# Altium project P22296-1.PrjPcb (part 2 of 3)

## Sheet BatteryMonitor.SchDoc: Titel
size A3; ApprovedBy: name; CompanyName: DCI Electronics bv; DrawnBy: KRS; Address1: Nijverheidsstraat 14; Address2: 4458 AV Eindewege; Address3: Phone: +31 (0)113 344880; DocumentNumber: 8; Revision: 2; SheetNumber: 8; SheetTotal: 14; PageSetup: Record=PageOptions|CenterHorizontal=True|CenterVertical=True|PrintScale=1.00|XCorrection=1.00|YCorrection=1.00|PrintKind=1|BorderSize=5000000|LeftOffset=0|BottomOffset=0|Orientation=2|PaperLength=1000|PaperWidth=1000|Scale=100|PaperSource=7|PrintQuality=-4|MediaType=1|DitherType=10|PaperKind=ISO_A4_(210.00_x_297.00_MM)|PrintScaleMode=1; SubTitle: SubTitel; ApprovedDate: 01-01-12; DesignedBy: KRS
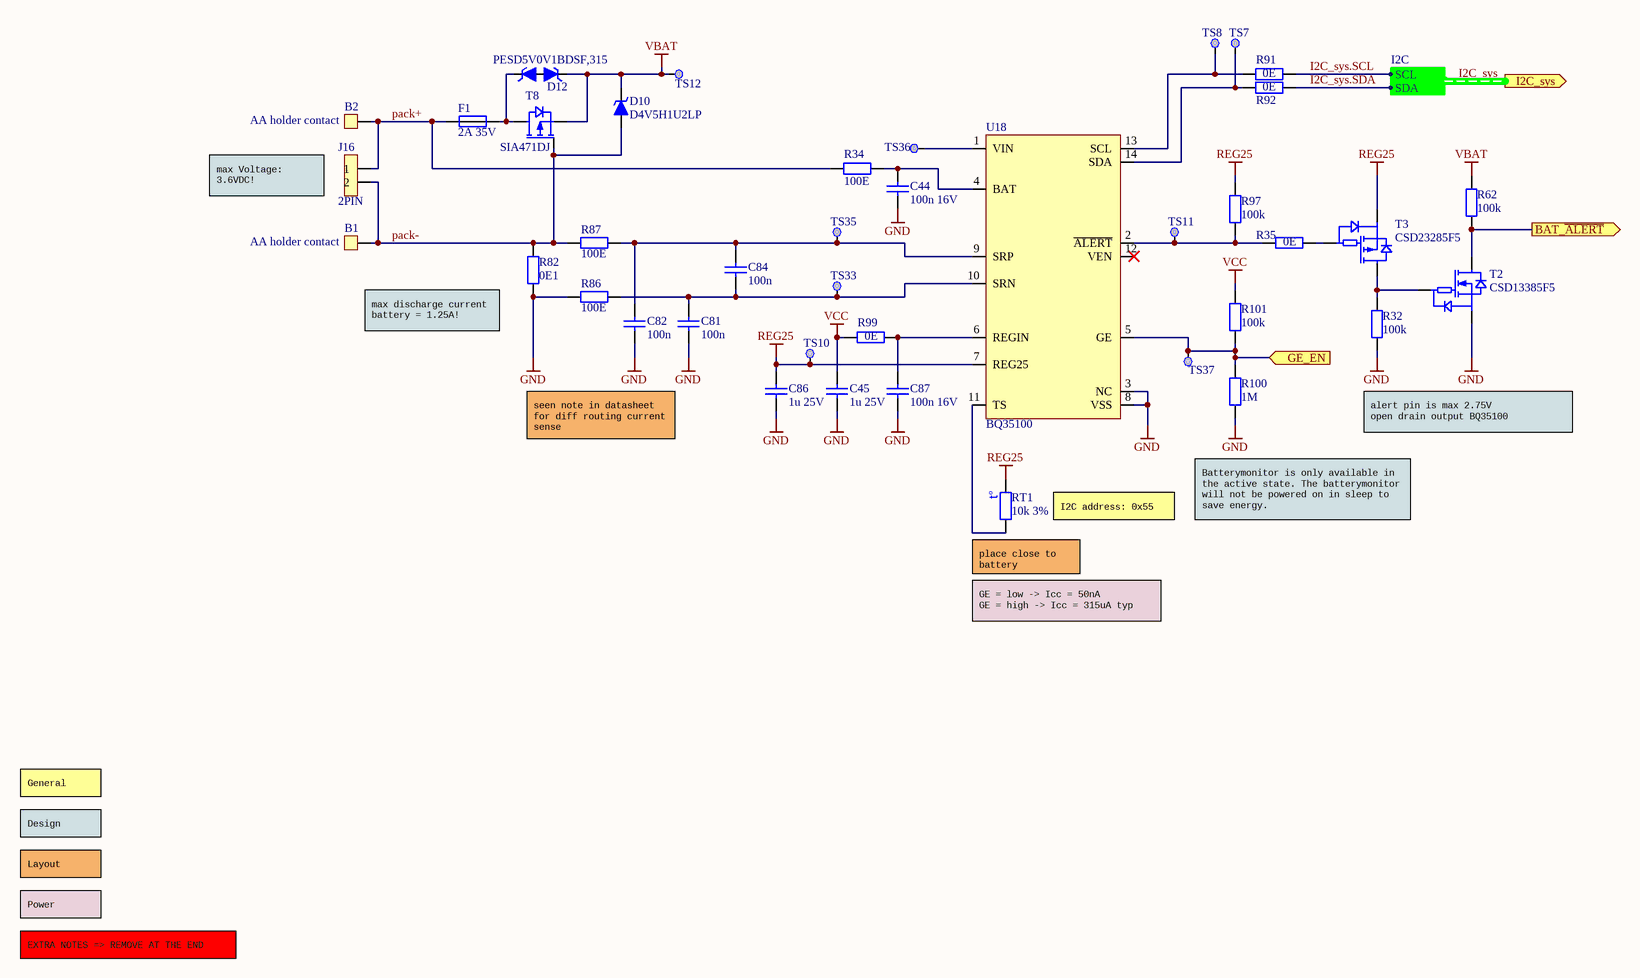
[diagram p7: BatteryMonitor.SchDoc]

### Parts
B1  AA holder contact  [ADD-900G002-000]
B2  AA holder contact  [ADD-900G002-000]
C44  100n 16V  [CAPC1005X05N]
C45  1u 25V  [CAPC1608X09N]
C81  100n  [CAPC1608X09N]
C82  100n  [CAPC1608X09N]
C84  100n  [CAPC1608X09N]
C86  1u 25V  [CAPC1608X09N]
C87  100n 16V  [CAPC1005X05N]
D10  D4V5H1U2LP  [DFN110P160X55-2N]
D12  PESD5V0V1BDSF,315  [DIO-000G003-002]
F1  2A 35V  [Fuse1608X05N]
J16  2PIN  [JST-B2B-PH-SM4-TB]
R32  100k  [RESC1005X04N]
R34  100E  [RESC1005X04N]
R35  0E  [RESC1005X04N]
R62  100k  [RESC1005X04N]
R82  0E1  [RESC3116X13L]
R86  100E  [RESC1608X13N]
R87  100E  [RESC1608X13N]
R91  0E  [RESC1005X04N]
R92  0E  [RESC1005X04N]
R97  100k  [RESC1005X04N]
R99  0E  [RESC1005X04N]
R100  1M  [RESC1005x04N]
R101  100k  [RESC1005X04N]
RT1  10k 3%  [RESC2013X14M]
T2  CSD13385F5  [DFN-500G000-003]
T3  CSD23285F5  [DFN-500G000-003]
T8  SIA471DJ  [PAK-SC70-6]
TS7  TESTPAD  [TESTPAD 2MM]  (value not drawn)  (no BOM)
TS8  TESTPAD  [TESTPAD 2MM]  (value not drawn)  (no BOM)
TS10  TESTPAD  [TESTPAD 2MM]  (value not drawn)  (no BOM)
TS11  TESTPAD  [TESTPAD 2MM]  (value not drawn)  (no BOM)
TS12  TESTPAD  [TESTPAD 2MM]  (value not drawn)  (no BOM)
TS33  TESTPOINT  [testpad 1.5 mm]  (value not drawn)  (no BOM)
TS35  TESTPOINT  [testpad 1.5 mm]  (value not drawn)  (no BOM)
TS36  TESTPAD  [TESTPAD 2MM]  (value not drawn)  (no BOM)
TS37  TESTPAD  [TESTPAD 2MM]  (value not drawn)  (no BOM)
U18  BQ35100  [SOP-650G001-014]

### Ports
BAT_~{ALERT} (out), GE_EN (in), I2C_sys (out, harness I2C)

### Harnesses
I2C: SDA, SCL

### Nets
GND: C44.1 C45.1 C81.1 C82.1 C86.1 C87.1 R32.1 R82.1 R86.1 R100.1 T2.S U18.3(NC) U18.8(VSS)
REG25: C86.2 R97.2 RT1.1 T3.S TS10.1(TP) U18.7(REG25)
VBAT: D10.C D12.C1 R62.2 T8.S TS12.1(TP)
VCC: C45.2 R99.1 R101.2
BAT_~{ALERT}: R62.1 T2.D ; port BAT_~{ALERT}
GE_EN: R100.2 R101.1 TS37.1(TP) U18.5(GE) ; port GE_EN
I2C_sys.SCL: R91.2 ; port I2C_sys.SCL
I2C_sys.SDA: R92.2 ; port I2C_sys.SDA
pack+: B2.1 F1.2 J16.1 R34.1  [project net pack+_8]
pack-: B1.1 D10.A J16.2 R82.2 R87.1 T8.G  [project net pack-_8]
NetC44_2: C44.2 R34.2 U18.4(BAT)
NetC81_2: C81.2 C84.1 R86.2 TS33.1(TP) U18.10(SRN)
NetC82_2: C82.2 C84.2 R87.2 TS35.1(TP) U18.9(SRP)
NetC87_2: C87.2 R99.2 U18.6(REGIN)
NetD12_C2: D12.C2 F1.1 T8.D
NetR32_2: R32.2 T2.G T3.D
NetR35_1: R35.1 R97.1 TS11.1(TP) U18.2(~{ALERT})
NetR35_2: R35.2 T3.G
NetR91_1: R91.1 TS8.1(TP) U18.13(SCL)
NetR92_1: R92.1 TS7.1(TP) U18.14(SDA)
NetRT1_2: RT1.2 U18.11(TS)
NetTS36_1: TS36.1(TP) U18.1(VIN)

Not connected (* = marked no-connect by the designer): U18 12(VEN)*

### Buses and harness runs
harness I2C_sys = port I2C_sys

### Notes on the sheet
- max Voltage: 3.6VDC!
- max discharge current battery = 1.25A!
- seen note in datasheet for diff routing current sense
- alert pin is max 2.75V
  open drain output BQ35100
- (near RT1) place close to battery
- (near RT1) I2C address: 0x55
- Batterymonitor is only available in the active state. The batterymonitor will not be powered on in sleep to save energy.
- GE = low -> Icc = 50nA
  GE = high -> Icc = 315uA typ
- Design
- General
- Layout
- Power
- EXTRA NOTES => REMOVE AT THE END
- Designed by:
- Drawing number:
- Variant:
- Date:
- Page:
- Rev:
- Of:
- Dekimo Goes B.V.
- Nijverheidsstraat 14, 4458 AV  Eindewege, Phone: +31 (0)113 344880
- (in symbol R 10K/NTC4) t°

### Library data of the parts
B1 B2 = BAT HLDRAA/1: Battery holder for AA cell; EngPartGrpMainCode: BAT; ManufactpartCode: KEYSTONE 92-KEY; Preferred: False; PartCode: BAT HLDRAA/1; Type: Battery accesoire; SMD_Flag: False
C44 C87 = CKE 100N/70: as C17 on sheet MCU; PartCode: CKE 100N/70
C45 C86 = CKE 1U/61: 1UF, 25V, 10%, 0603, X7R; EngPartGrpMainCode: CAP; ManufactpartCode: CL10B105KA8NNNC-SAM; Type: Capacitor ceramic SMD; Preferred: False; SMD_Flag: True; PartCode: CKE 1U/61
C81 C82 C84 = CKE 100N/60: as C77 on sheet MCU; PartCode: CKE 100N/60
D10 = DIO D4V5H1U2LP: TVS diode 4,5V unidirec; EngPartGrpMainCode: DIO; ManufactpartCode: D4V5H1U2LP1610-7-DIO; Type: Diode suppressor SMD; Preferred: False; SMD_Flag: True; PartCode: DIO D4V5H1U2LP
D12 = DIO PESD5V0V1BB: TVS diode 5V bidirec; EngPartGrpMainCode: DIO; ManufactpartCode: PESD5V0V1BB-QX-NEX; Type: Diode suppressor SMD; Preferred: False; SMD_Flag: True; PartCode: DIO PESD5V0V1BB
F1 = FUSE 2AT/3: 2A High inrush SMD; ManufactpartCode: SF-0603HI200F-2-BRN; Type: Fuse SMD; Preferred: False; SMD_Flag: True; PartCode: FUSE 2AT/3; EngPartGrpMainCode: FUSE
J16 = CON JSTB2BPHSM4: JST PH 2p top entry 2A SMD; EngPartGrpMainCode: CONN; ManufactpartCode: B2B-PH-SM4-TB(LF)(SN)-JST; Preferred: False; SMD_Flag: True; PartCode: CON JSTB2BPHSM4; Type: Connector Boxed Header SMD
R32 R62 R97 R101 = R 100K/70: as R14 on sheet MCU; PartCode: R 100K/70; Type: Resistor metalfilm SMD
R34 = R 100E/70: 100E, 62.5mW, 1%; EngPartGrpMainCode: RES; ManufactpartCode: RC0402FR-07100RL-YAG; Preferred: False; SMD_Flag: True; PartCode: R 100E/70; Type: Resistor metalfilm SMD
R35 R91 R92 R99 = R 0E/70: as R8 on sheet MCU; Type: Resistor metalfilm SMD
R82 = R 0E1/0W5/10: 0E1 1% 0,5W 50ppm; EngPartGrpMainCode: RES; ManufactpartCode: KDV12FR100ET-OHM; Preferred: False; SMD_Flag: True; PartCode: R 0E1/0W5/10; Type: Resistor powerfilm SMD
R86 R87 = R 100E/60: 100E 100mW, 1%; EngPartGrpMainCode: RES; ManufactpartCode: RC0603FR-07100RL-YAG; Preferred: True; PartCode: R 100E/60; Type: Resistor metalfilm SMD; SMD_Flag: True
R100 = R 1M/70: as R18 on sheet MCU; Type: Resistor metalfilm SMD
RT1 = R 10K/NTC4: NTC 10K 3% SMD 0805; EngPartGrpMainCode: RES; ManufactpartCode: NTCS0805E3103JMT-VIS; Preferred: False; SMD_Flag: True; PartCode: R 10K/NTC4; Type: Resistor NTC PTC LDR sens. SMD
T2 = TRA CSD13385F5: as T11 on sheet Sensor; PartCode: TRA CSD13385F5
T3 = TRA CSD23285F5: 3.3A, 12V, P-channel FemtoFet; EngPartGrpMainCode: TRAN; ManufactpartCode: CSD23285F5-TI; Type: FET P-channel SMD; Preferred: False; SMD_Flag: True; PartCode: TRA CSD23285F5
T8 = TRA SIA471DJ-T1: 30V 12.9A 0.014E logic level; EngPartGrpMainCode: TRAN; ManufactpartCode: SIA471DJ-T1-GE3-VIS; Type: FET P-channel SMD; Preferred: False; SMD_Flag: True; PartCode: TRA SIA471DJ-T1
TS7 TS8 TS10-TS12 TS36 TS37 = TESTPAD-2.0: 0.5mm Testpad SMD; PartCode: TESTPAD-2.0
U18 = IC BQ35100: Lithium Fuel Gauge; EngPartGrpMainCode: IC; ManufactpartCode: BQ35100PW-TI; Preferred: False; SMD_Flag: True; PartCode: IC BQ35100; Type: IC analog SMD

## Sheet Mechanical.SchDoc: Titel
size A3; DesignedDate: 01-01-12; CompanyName: DCI Electronics bv; DrawnBy: KRS; Organization: DCI Electronics; Address1: Nijverheidsstraat 14; Address2: 4458 AV Eindewege; Address3: Phone: +31 (0)113 344880; DocumentNumber: 0; Revision: 0; SheetNumber: 14; SheetTotal: 14; PageSetup: Record=PageOptions|CenterHorizontal=True|CenterVertical=True|PrintScale=1.00|XCorrection=1.00|YCorrection=1.00|PrintKind=1|BorderSize=5000000|LeftOffset=0|BottomOffset=0|Orientation=2|PaperLength=1000|PaperWidth=1000|Scale=100|PaperSource=7|PrintQuality=-4|MediaType=1|DitherType=10|PaperKind=ISO_A4_(210.00_x_297.00_MM)|PrintScaleMode=1; SubTitle: SubTitel; ApprovedDate: 01-01-12; DesignedBy: HMK
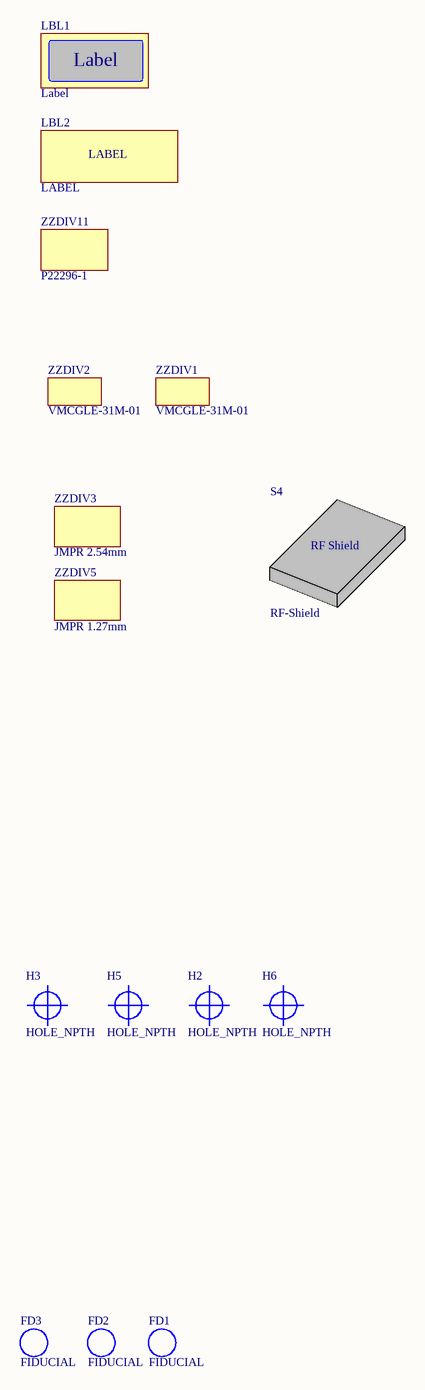
[diagram p8: Mechanical.SchDoc]

### Parts
FD1  FIDUCIAL  [fiducial1.5MM]
FD2  FIDUCIAL  [fiducial1.5MM]
FD3  FIDUCIAL  [fiducial1.5MM]
H2  HOLE_NPTH  [NPTH_3.0]  (no BOM)
H3  HOLE_NPTH  [NPTH_3.0]  (no BOM)
H5  HOLE_NPTH  [NPTH_3.0]  (no BOM)
H6  HOLE_NPTH  [NPTH_SLOT_3.0_6.0]  (no BOM)
LBL1  Label  [LABEL_12.7X25.4]
LBL2  LABEL  [Label_5x15]  (no BOM)
S4  RF-Shield  (mechanical)
ZZDIV1  VMCGLE-31M-01  [ADD-903000-001]
ZZDIV2  VMCGLE-31M-01  [ADD-903000-001]
ZZDIV3  JMPR 2.54mm  (mechanical)
ZZDIV5  JMPR 1.27mm  (mechanical)
ZZDIV11  P22296-1  (mechanical)

### Notes on the sheet
- Designed by:
- Drawing number:
- Variant:
- Date:
- Page:
- Rev:
- Of:
- Dekimo Goes B.V.
- Nijverheidsstraat 14, 4458 AV  Eindewege, Phone: +31 (0)113 344880
- (in symbol MEC SHIELD/2) RF Shield

### Library data of the parts
LBL1 = LBL STCK/20: Multi-funct labels12.7 x25.4mm; EngPartGrpMainCode: CASE; SMD_Flag: False; PartCode: LBL STCK/20; Type: Standard Label; ManufactpartCode: -; Preferred: False
LBL2 = LABEL: Production Label; PartCode: LABEL
S4 = MEC SHIELD/2: PCB SMD shield cap; Manufacturer: Masach Tech; Manufacturer_Part_Number: MS409-10; EngPartGrpMainCode: MEC; ManufactpartCode: 2118717-2-TEC; Preferred: False; PartCode: MEC SHIELD/2; Type: Various PCB Components; SMD_Flag: False
ZZDIV1 ZZDIV2 = MEC PCBGUIDE/2: Vertical card guide 30mm; EngPartGrpMainCode: MEC; ManufactpartCode: VMCGLE-31M-01-ESS; Preferred: False; PartCode: MEC PCBGUIDE/2; Type: Various; SMD_Flag: False
ZZDIV3 = DIV JMPR/6: Jumper 2.54; EngPartGrpMainCode: CONN; ManufactpartCode: 0-142270-1; Remark: J24; Preferred: False; PartCode: DIV JMPR/6; Type: Jumper; SMD_Flag: False
ZZDIV5 = DIV JMPR/9: SN,HANDGR,W2.5,,H3,D1.27; EngPartGrpMainCode: CONN; ManufactpartCode: M50-1900005-HAR; Remark: J11 1-2; Preferred: False; PartCode: DIV JMPR/9; Type: Jumper; SMD_Flag: False
ZZDIV11 = PCB P22296-1: MFM Basis; EngPartGrpMainCode: PCB; Preferred: False; PartCode: PCB P22296-1; Type: $PCB; ManufactpartCode: P22296-1; SMD_Flag: False

## Sheet Memory.SchDoc: Titel
size A3; ApprovedBy: name; CompanyName: DCI Electronics bv; DrawnBy: KRS; Address1: Nijverheidsstraat 14; Address2: 4458 AV Eindewege; Address3: Phone: +31 (0)113 344880; DocumentNumber: 9; Revision: 1; SheetNumber: 9; SheetTotal: 14; PageSetup: Record=PageOptions|CenterHorizontal=True|CenterVertical=True|PrintScale=1.00|XCorrection=1.00|YCorrection=1.00|PrintKind=1|BorderSize=5000000|LeftOffset=0|BottomOffset=0|Orientation=2|PaperLength=1000|PaperWidth=1000|Scale=100|PaperSource=7|PrintQuality=-4|MediaType=1|DitherType=10|PaperKind=ISO_A4_(210.00_x_297.00_MM)|PrintScaleMode=1; SubTitle: SubTitel; ApprovedDate: 01-01-12; DesignedBy: HMK
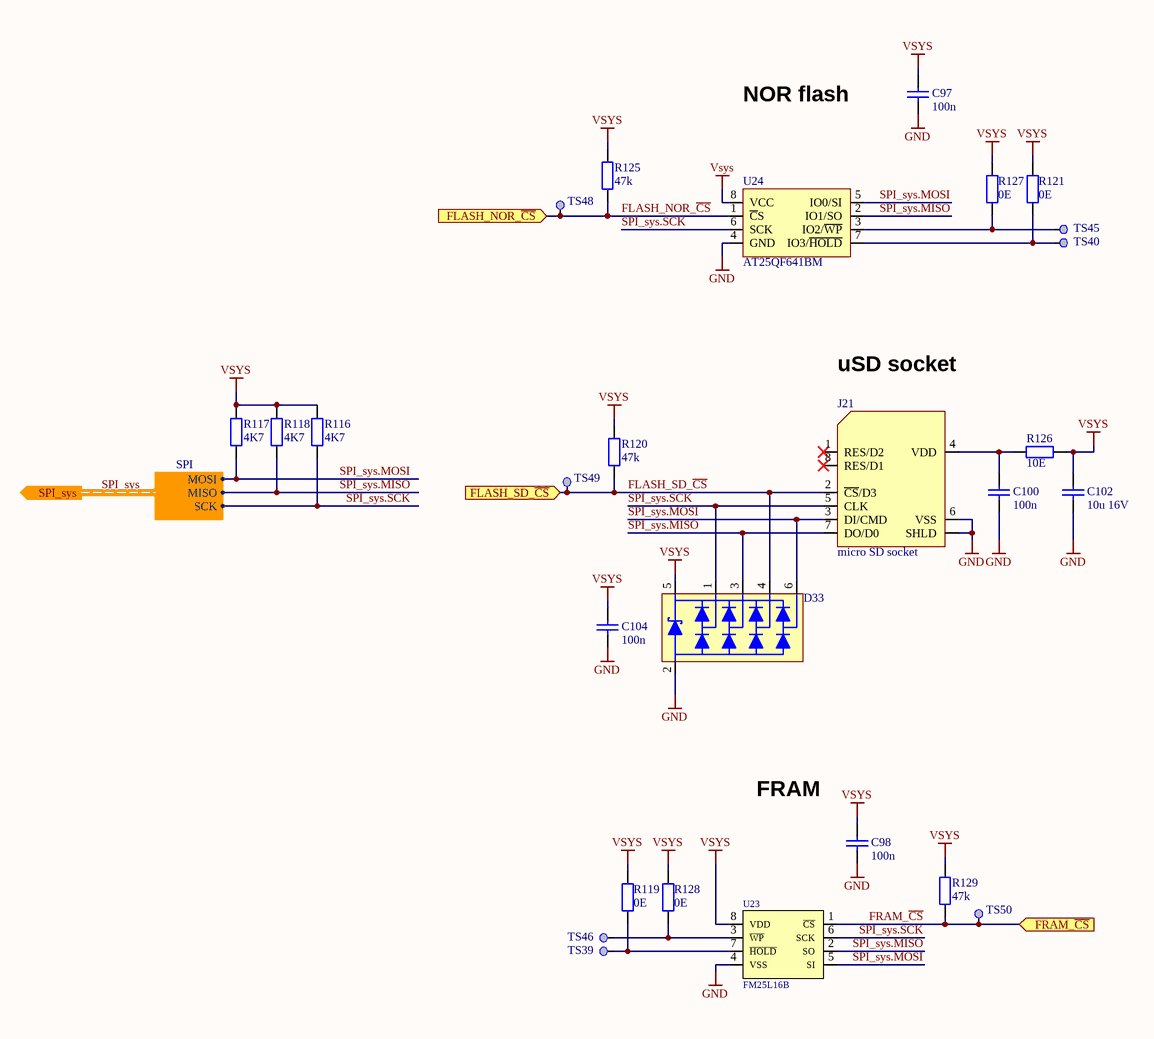
[diagram p9: Memory.SchDoc]

### Parts
C97  100n  [CAPC1608X09N]
C98  100n  [CAPC1608X09N]
C100  100n  [CAPC1608X09N]
C102  10u 16V  [CAPC1608X09N]
C104  100n  [CAPC1608X09N]
D33  (no value)  [SOT95P280X145-6N]
J21  micro SD socket  [CON-170G000-009]
R116  4K7  [RESC1005x04N]
R117  4K7  [RESC1005x04N]
R118  4K7  [RESC1005x04N]
R119  0E  [RESC1005X04N]
R120  47k  [RESC1608X13N]
R121  0E  [RESC1005X04N]
R125  47k  [RESC1608X13N]
R126  10E  [RESC1608X13N]
R127  0E  [RESC1005X04N]
R128  0E  [RESC1005X04N]
R129  47k  [RESC1608X13N]
TS39  TESTPAD  [TESTPAD 2MM]  (value not drawn)  (no BOM)
TS40  TESTPAD  [TESTPAD 2MM]  (value not drawn)  (no BOM)
TS45  TESTPAD  [TESTPAD 2MM]  (value not drawn)  (no BOM)
TS46  TESTPAD  [TESTPAD 2MM]  (value not drawn)  (no BOM)
TS48  TESTPAD  [TESTPAD 2MM]  (value not drawn)  (no BOM)
TS49  TESTPAD  [TESTPAD 2MM]  (value not drawn)  (no BOM)
TS50  TESTPAD  [TESTPAD 2MM]  (value not drawn)  (no BOM)
U23  FM25L16B  [SOP-120g001-008]
U24  AT25QF641BM  [SON127P500X600X60-9N]

### Ports
FLASH_NOR_~{CS} (in), FLASH_SD_~{CS} (in), FRAM_~{CS} (in), SPI_sys (out, harness SPI)

### Harnesses
SPI: SCK, MISO, MOSI

### Nets
GND: C97.1 C98.1 C100.1 C102.1 C104.1 D33.2(A) J21.6(VSS) J21.SHLD U23.4(VSS) U24.4(GND)
VSYS: C97.2 C98.2 C102.2 C104.2 D33.5(A) R116.2 R117.2 R118.2 R119.2 R120.2 R121.2 R125.2 R126.1 R127.2 R128.2 R129.2 U23.8(VDD) U24.8(VCC)
FLASH_NOR_~{CS}: R125.1 TS48.1(TP) U24.1(~{C}S) ; port FLASH_NOR_~{CS}
FLASH_SD_~{CS}: D33.4(A) J21.2(~{CS}/D3) R120.1 TS49.1(TP) ; port FLASH_SD_~{CS}
FRAM_~{CS}: R129.1 TS50.1(TP) U23.1(~{CS}) ; port FRAM_~{CS}
SPI_sys.MISO: D33.3(A) J21.7(DO/D0) R118.1 U23.2(SO) U24.2(IO1/SO) ; port SPI_sys.MISO
SPI_sys.MOSI: D33.6(A) J21.3(DI/CMD) R117.1 U23.5(SI) U24.5(IO0/SI) ; port SPI_sys.MOSI
SPI_sys.SCK: D33.1(A) J21.5(CLK) R116.1 U23.6(SCK) U24.6(SCK) ; port SPI_sys.SCK
NetC100_2: C100.2 J21.4(VDD) R126.2
NetR119_1: R119.1 TS39.1(TP) U23.7(~{HOLD})
NetR121_1: R121.1 TS40.1(TP) U24.7(IO3/~{HOLD})
NetR127_1: R127.1 TS45.1(TP) U24.3(IO2/~{WP})
NetR128_1: R128.1 TS46.1(TP) U23.3(~{WP})

Not connected (* = marked no-connect by the designer): J21 1(RES/D2)* 8(RES/D1)*

### Buses and harness runs
harness SPI_sys = port SPI_sys

### Notes on the sheet
- NOR flash
- uSD socket
- FRAM
- Designed by:
- Drawing number:
- Variant:
- Date:
- Page:
- Rev:
- Of:
- Dekimo Goes B.V.
- Nijverheidsstraat 14, 4458 AV  Eindewege, Phone: +31 (0)113 344880

### Library data of the parts
C97 C98 C100 C104 = CKE 100N/60: 100nF 50V 10% X7R; EngPartGrpMainCode: CAP; ManufactpartCode: 2238 586 15649-PHI; Type: Capacitor ceramic SMD; Preferred: False; SMD_Flag: True; PartCode: CKE 100N/60
C102 = CKE 10UV16/60: 10uF 16V ±10% X5R; EngPartGrpMainCode: CAP; ManufactpartCode: GRM188R61C106KAALD-MUR; Type: Capacitor ceramic SMD; Preferred: False; SMD_Flag: True; PartCode: CKE 10UV16/60
D33 = DIO SRV05-4: quadruple  Hi speed clamp,5V; EngPartGrpMainCode: DIO; ManufactpartCode: SRV05-4.TCT -SEM; Type: TVS diode array SMD; Preferred: False; SMD_Flag: True; PartCode: DIO SRV05-4
J21 = CON SD/15: micro SD card hinged; EngPartGrpMainCode: CONN; ManufactpartCode: MEM2067-02-180-00-A-GCT; Preferred: False; SMD_Flag: True; PartCode: CON SD/15; Type: Connector SD/MMC SMD
R116-R118 = R 4K7/70: 4K7, 62.5mW, 1%; EngPartGrpMainCode: RES; ManufactpartCode: RC0402FR-074K7L-YAG; Preferred: False; SMD_Flag: True; PartCode: R 4K7/70; Type: Resistor metalfilm SMD
R119 R121 R127 R128 = R 0E/70: 0E, 62.5mW, 1%; PartCode: R 0E/70; EngPartGrpMainCode: RES; ManufactpartCode: RC0402JR-070RL-YAG; Preferred: False; SMD_Flag: True; Type: Resistor metalfilm SMD
R120 R125 R129 = R 47K/60: 47k 100mW 1%; EngPartGrpMainCode: RES; ManufactpartCode: RC0603FR-0747KL-YAG; Preferred: False; SMD_Flag: True; PartCode: R 47K/60; Type: Resistor metalfilm SMD
R126 = R 10E/60: 10E 0.1W 1%; EngPartGrpMainCode: RES; ManufactpartCode: RC0603FR-0710RL-YAG; Preferred: False; SMD_Flag: True; PartCode: R 10E/60; Type: Resistor metalfilm SMD
TS39 TS40 TS45 TS46 TS48-TS50 = TESTPAD-2.0: 0.5mm Testpad SMD; PartCode: TESTPAD-2.0
U23 = IC FM25L16B: 16k, SPI, FRAM; EngPartGrpMainCode: IC; ManufactpartCode: FM25L16B-GTR-INF; Preferred: False; SMD_Flag: True; PartCode: IC FM25L16B; Type: IC EEPROM smd
U24 = IC AT25QF641BM: AT25QF641b 64Mbit dataflash; EngPartGrpMainCode: IC; ManufactpartCode: AT25QF641B-MHB-T-ADE; Preferred: False; SMD_Flag: True; PartCode: IC AT25QF641BM; Type: IC Flash SMD

## Sheet RTC.SchDoc: Titel
size A3; ApprovedBy: name; CompanyName: DCI Electronics bv; DrawnBy: KRS; Address1: Nijverheidsstraat 14; Address2: 4458 AV Eindewege; Address3: Phone: +31 (0)113 344880; DocumentNumber: 10; Revision: 2; SheetNumber: 10; SheetTotal: 14; PageSetup: Record=PageOptions|CenterHorizontal=True|CenterVertical=True|PrintScale=1.00|XCorrection=1.00|YCorrection=1.00|PrintKind=1|BorderSize=5000000|LeftOffset=0|BottomOffset=0|Orientation=2|PaperLength=1000|PaperWidth=1000|Scale=100|PaperSource=7|PrintQuality=-4|MediaType=1|DitherType=10|PaperKind=ISO_A4_(210.00_x_297.00_MM)|PrintScaleMode=1; SubTitle: SubTitel; ApprovedDate: 01-01-12; DesignedBy: HMK
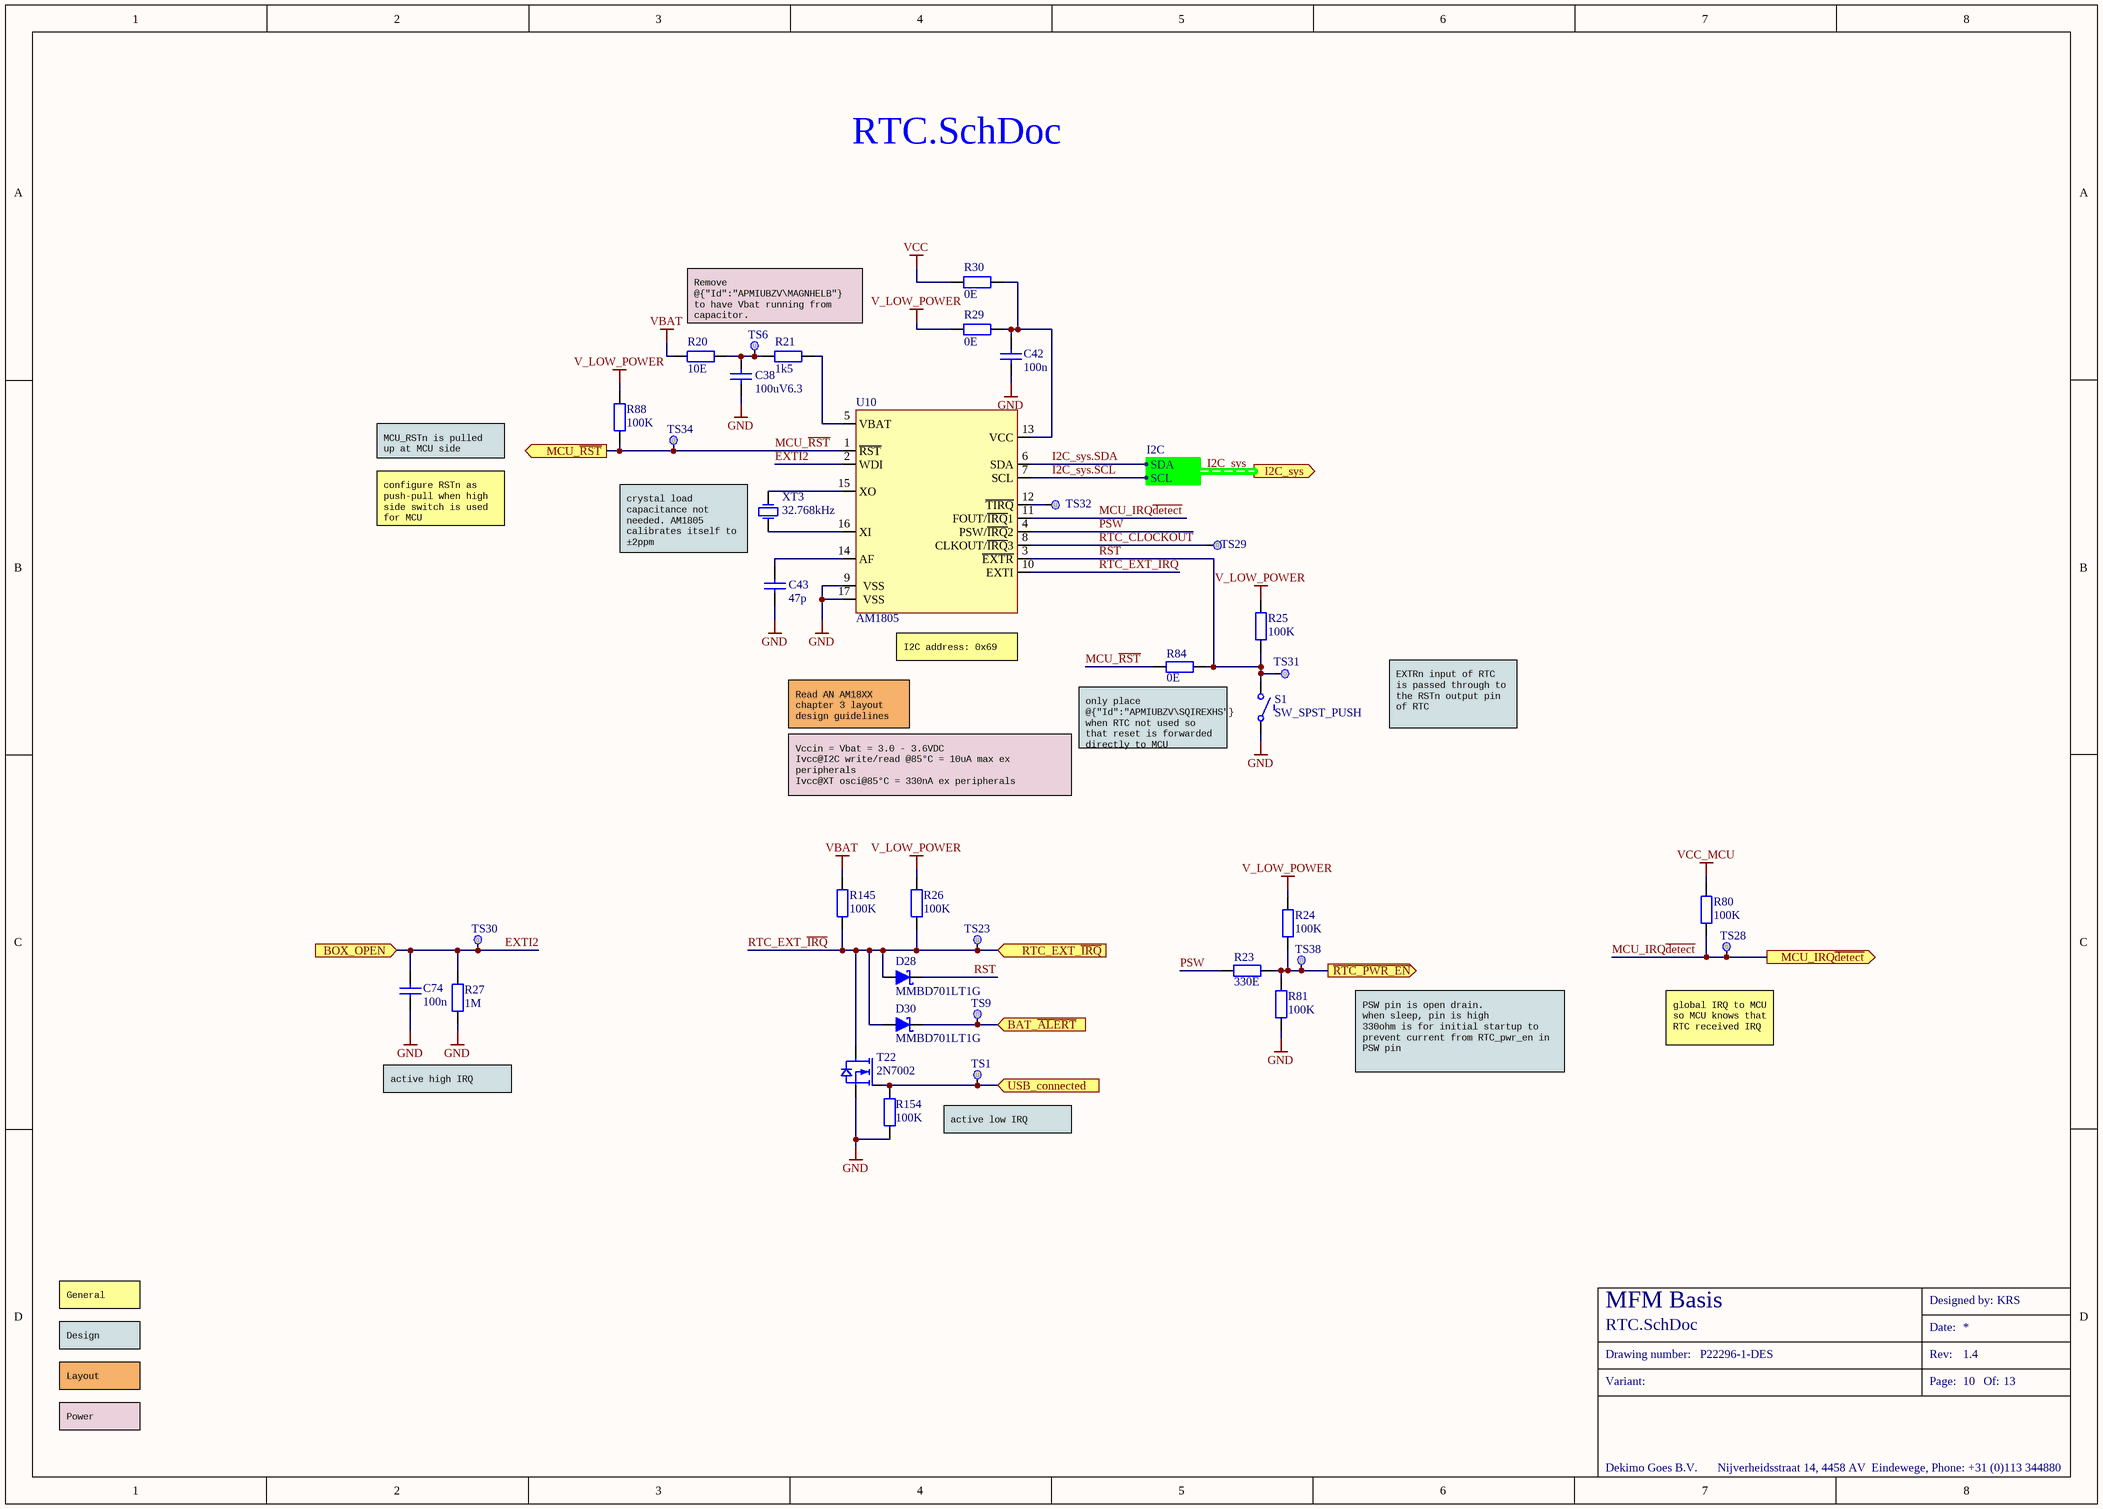
[diagram p10: RTC.SchDoc]

### Parts
C38  100uV6.3  [CAPC3216X13N]
C42  100n  [CAPC1608X09N]
C43  47p  [CAPC1608X09N]
C74  100n  [CAPC1608X09N]
D28  MMBD701LT1G  [SOT95P245X110-3N]
D30  MMBD701LT1G  [SOT95P245X110-3N]
R20  10E  [RESC1608X13N]
R21  1k5  [RESC1608X13N]
R23  330E  [RESC1608X13N]
R24  100K  [RESC1608X13N]
R25  100K  [RESC1608X13N]
R26  100K  [RESC1608X13N]
R27  1M  [RESC1608X13N]
R29  0E  [RESC1005X04N]
R30  0E  [RESC1005X04N]
R80  100K  [RESC1608X13N]
R81  100K  [RESC1608X13N]
R84  0E  [RESC1608X13N]
R88  100K  [RESC1608X13N]
R145  100K  [RESC1608X13N]
R154  100K  [RESC1608X13N]
S1  SW_SPST_PUSH  [B3S-1000P]
T22  2N7002  [SOT95P245X110_GSD-3N]
TS1  TESTPAD  [TESTPAD 2MM]  (value not drawn)  (no BOM)
TS6  TESTPAD  [TESTPAD 2MM]  (value not drawn)  (no BOM)
TS9  TESTPAD  [TESTPAD 2MM]  (value not drawn)  (no BOM)
TS23  TESTPAD  [TESTPAD 2MM]  (value not drawn)  (no BOM)
TS28  TESTPAD  [TESTPAD 2MM]  (value not drawn)  (no BOM)
TS29  TESTPAD  [TESTPAD 2MM]  (value not drawn)  (no BOM)
TS30  TESTPAD  [TESTPAD 2MM]  (value not drawn)  (no BOM)
TS31  TESTPAD  [TESTPAD 2MM]  (value not drawn)  (no BOM)
TS32  TESTPAD  [TESTPAD 2MM]  (value not drawn)  (no BOM)
TS34  TESTPAD  [TESTPAD 2MM]  (value not drawn)  (no BOM)
TS38  TESTPAD  [TESTPAD 2MM]  (value not drawn)  (no BOM)
U10  AM1805  [QFN-500G000-016]
XT3  32.768kHz  [CHIP2PINSM127P600-8N]

### Ports
BAT_~{ALERT} (in), BOX_OPEN (in), I2C_sys (out, harness I2C), MCU_IRQ~{detect} (out), MCU_~{RST} (out), RTC_EXT_~{IRQ} (in), USB_connected (in), ~{RTC_PWR_EN} (out)

### Harnesses
I2C: SDA, SCL

### Nets
GND: C38.1 C42.1 C43.1 C74.1 R27.1 R81.1 R154.1 S1.COM1(COMMON) T22.S U10.9(VSS) U10.17(VSS)
V_LOW_POWER: R24.2 R25.2 R26.2 R29.1 R88.2
VBAT: R20.1 R145.2
VCC: R30.1
VCC_MCU: R80.2
\: D28.C R25.1 R84.2 S1.NO1(NO) TS31.1(TP) U10.3(~{EXTR})  [also labelled RST]  [project net ~{_10}]
~{RTC_PWR_EN}: R23.2 R24.1 R81.2 TS38.1(TP) ; port ~{RTC_PWR_EN}
BAT_~{ALERT}: D30.C TS9.1(TP) ; port BAT_~{ALERT}
EXTI2: C74.2 R27.2 TS30.1(TP) U10.2(WDI) ; port BOX_OPEN  [project net BOX_OPEN]
I2C_sys.SCL: U10.7(SCL) ; port I2C_sys.SCL
I2C_sys.SDA: U10.6(SDA) ; port I2C_sys.SDA
MCU_IRQ~{detect}: R80.1 TS28.1(TP) U10.11(FOUT/~{IRQ}1) ; port MCU_IRQ~{detect}
MCU_~{RST}: R84.1 R88.1 TS34.1(TP) U10.1(~{RST}) ; port MCU_~{RST}
PSW: R23.1 U10.4(PSW/~{IRQ}2)  [project net PSW_10]
RTC_CLOCKOUT: TS29.1(TP) U10.8(CLKOUT/~{IRQ}3)  [project net RTC_CLOCKOUT_10]
RTC_EXT_~{IRQ}: D28.A D30.A R26.1 R145.1 T22.D TS23.1(TP) U10.10(EXTI) ; port RTC_EXT_~{IRQ}
USB_connected: R154.2 T22.G TS1.1(TP) ; port USB_connected
NetC38_2: C38.2 R20.2 R21.1 TS6.1(TP)
NetC42_2: C42.2 R29.2 R30.2 U10.13(VCC)
NetC43_2: C43.2 U10.14(AF)
NetR21_2: R21.2 U10.5(VBAT)
NetTS32_1: TS32.1(TP) U10.12(~{TIRQ})
NetU10_15: U10.15(XO) XT3.2(OSC2)
NetU10_16: U10.16(XI) XT3.1(OSC1)

### Buses and harness runs
harness I2C_sys = port I2C_sys

### Notes on the sheet
- Remove @{"Id":"APMIUBZV\MAGNHELB"} to have Vbat running from capacitor.
  100uF gives about 1.7h run time in autocal mode
- MCU_RSTn is pulled up at MCU side
- configure RSTn as push-pull when high side switch is used for MCU
- (near XT3) crystal load capacitance not needed. AM1805 calibrates itself to ±2ppm
- Read AN AM18XX chapter 3 layout design guidelines
- (near U10) I2C address: 0x69
- EXTRn input of RTC is passed through to the RSTn output pin of RTC
- only place @{"Id":"APMIUBZV\SQIREXHS"} when RTC not used so that reset is forwarded directly to MCU
- Vccin = Vbat = 3.0 - 3.6VDC
  Ivcc@I2C write/read @85°C = 10uA max ex peripherals
  Ivcc@XT osci@85°C = 330nA ex peripherals
- (near TS28) global IRQ to MCU so MCU knows that RTC received IRQ
- active high IRQ
- (near TS1) active low IRQ
- PSW pin is open drain.
  when sleep, pin is high
  330ohm is for initial startup to prevent current from RTC_pwr_en in PSW pin
- General
- Design
- Layout
- Power
- Designed by:
- Drawing number:
- Variant:
- Date:
- Page:
- Rev:
- Of:
- Dekimo Goes B.V.
- Nijverheidsstraat 14, 4458 AV  Eindewege, Phone: +31 (0)113 344880

### Library data of the parts
C38 = CKE 100UV6.3/10: 100uF 20% 6.3VX5R; EngPartGrpMainCode: CAP; ManufactpartCode: GRM31CR60J107ME39L-MUR; Type: Capacitor ceramic SMD; Preferred: False; SMD_Flag: True; PartCode: CKE 100UV6.3/10
C42 C74 = CKE 100N/60: 100nF 50V 10% X7R; EngPartGrpMainCode: CAP; ManufactpartCode: CC0603KRX7R9BB104-YAG; Type: Capacitor ceramic SMD; Preferred: False; SMD_Flag: True; PartCode: CKE 100N/60
C43 = CKE 47P/60: 47p 50V 5% NP0; EngPartGrpMainCode: CAP; ManufactpartCode: CC0603JRNPO9BN470-YAG; Type: Capacitor ceramic SMD; Preferred: False; SMD_Flag: True; PartCode: CKE 47P/60
D28 D30 = DIO MMBD701LT1G: 70V Low leakage 200nA; EngPartGrpMainCode: DIO; ManufactpartCode: MMBD701LT1G-ONS; Type: Diode schottky SMD; Preferred: False; SMD_Flag: True; PartCode: DIO MMBD701LT1G
R20 = R 10E/60: as R126 on sheet Memory; PartCode: R 10E/60; Type: Resistor metalfilm SMD
R21 = R 1K5/60: 1K5, 100mW, 1%; EngPartGrpMainCode: RES; ManufactpartCode: RC0603FR-071K5L-YAG; Preferred: False; SMD_Flag: True; PartCode: R 1K5/60; Type: Resistor metalfilm SMD
R23 = R 330E/60: 330E, 100mW, 1%; EngPartGrpMainCode: RES; ManufactpartCode: RC0603FR-07330RL-YAG; Preferred: True; PartCode: R 330E/60; Type: Resistor metalfilm SMD; SMD_Flag: True
R24-R26 R80 R81 R88 R145 R154 = R 100K/60: 100k 100mW, 1%; EngPartGrpMainCode: RES; ManufactpartCode: CRG0603F100K-TEC; Preferred: True; PartCode: R 100K/60; Type: Resistor metalfilm SMD; SMD_Flag: True
R27 = R 1M/60: 1M 0.1W 1%; PartCode: R 1M/60; EngPartGrpMainCode: RES; ManufactpartCode: RC0603FR-071ML-YAG; Preferred: False; SMD_Flag: True; Type: Resistor metalfilm SMD
R29 R30 = R 0E/70: as R119 on sheet Memory; Type: Resistor metalfilm SMD
R84 = R 0E/60: 0E 100mW, 1%; PartCode: R 0E/60; EngPartGrpMainCode: RES; ManufactpartCode: RC0603FR-070RL-YAG; Preferred: True; Type: Resistor metalfilm SMD; SMD_Flag: True
S1 = SW PBSPNO/25: PCB SPNO 6x6.6mm, h=4,3mm refl; EngPartGrpMainCode: SWI; ManufactpartCode: B3S-1000P-OMR; Preferred: False; SMD_Flag: True; PartCode: SW PBSPNO/25; Type: Switch push button SMD
T22 = TRA 2N7002: 60V 115mA; EngPartGrpMainCode: TRAN; ManufactpartCode: 2N7002-PHI; Type: FET N-channel SMD; Preferred: False; SMD_Flag: True; PartCode: TRA 2N7002
TS1 TS6 TS9 TS23 TS28-TS32 TS34 TS38 = TESTPAD-2.0: 0.5mm Testpad SMD; PartCode: TESTPAD-2.0
U10 = IC AM1805: Low power I2C RTC; EngPartGrpMainCode: IC; ManufactpartCode: AM1805AQ-AMB; Preferred: False; SMD_Flag: True; PartCode: IC AM1805; Type: IC RTC SMD
XT3 = XT 32.768KHZ/S2: 32.768kHz 20ppm 12.5pF; ManufactpartCode: FC-135 32.7680KA-A3-EPS; Preferred: False; SMD_Flag: True; PartCode: XT 32.768KHZ/S2; EngPartGrpMainCode: XTAL; Type: Quarz crystal SMD

## Sheet USB.SchDoc: Titel
size A3; DesignedDate: 01-01-12; CompanyName: DCI Electronics bv; DrawnBy: KRS; Organization: DCI Electronics; Address1: Nijverheidsstraat 14; Address2: 4458 AV Eindewege; Address3: Phone: +31 (0)113 344880; DocumentNumber: 3; Revision: 1; SheetNumber: 3; SheetTotal: 14; PageSetup: Record=PageOptions|CenterHorizontal=True|CenterVertical=True|PrintScale=1.00|XCorrection=1.00|YCorrection=1.00|PrintKind=1|BorderSize=5000000|LeftOffset=0|BottomOffset=0|Orientation=2|PaperLength=1000|PaperWidth=1000|Scale=100|PaperSource=7|PrintQuality=-4|MediaType=1|DitherType=10|PaperKind=ISO_A4_(210.00_x_297.00_MM)|PrintScaleMode=1; SubTitle: SubTitel; DesignedBy: HMK
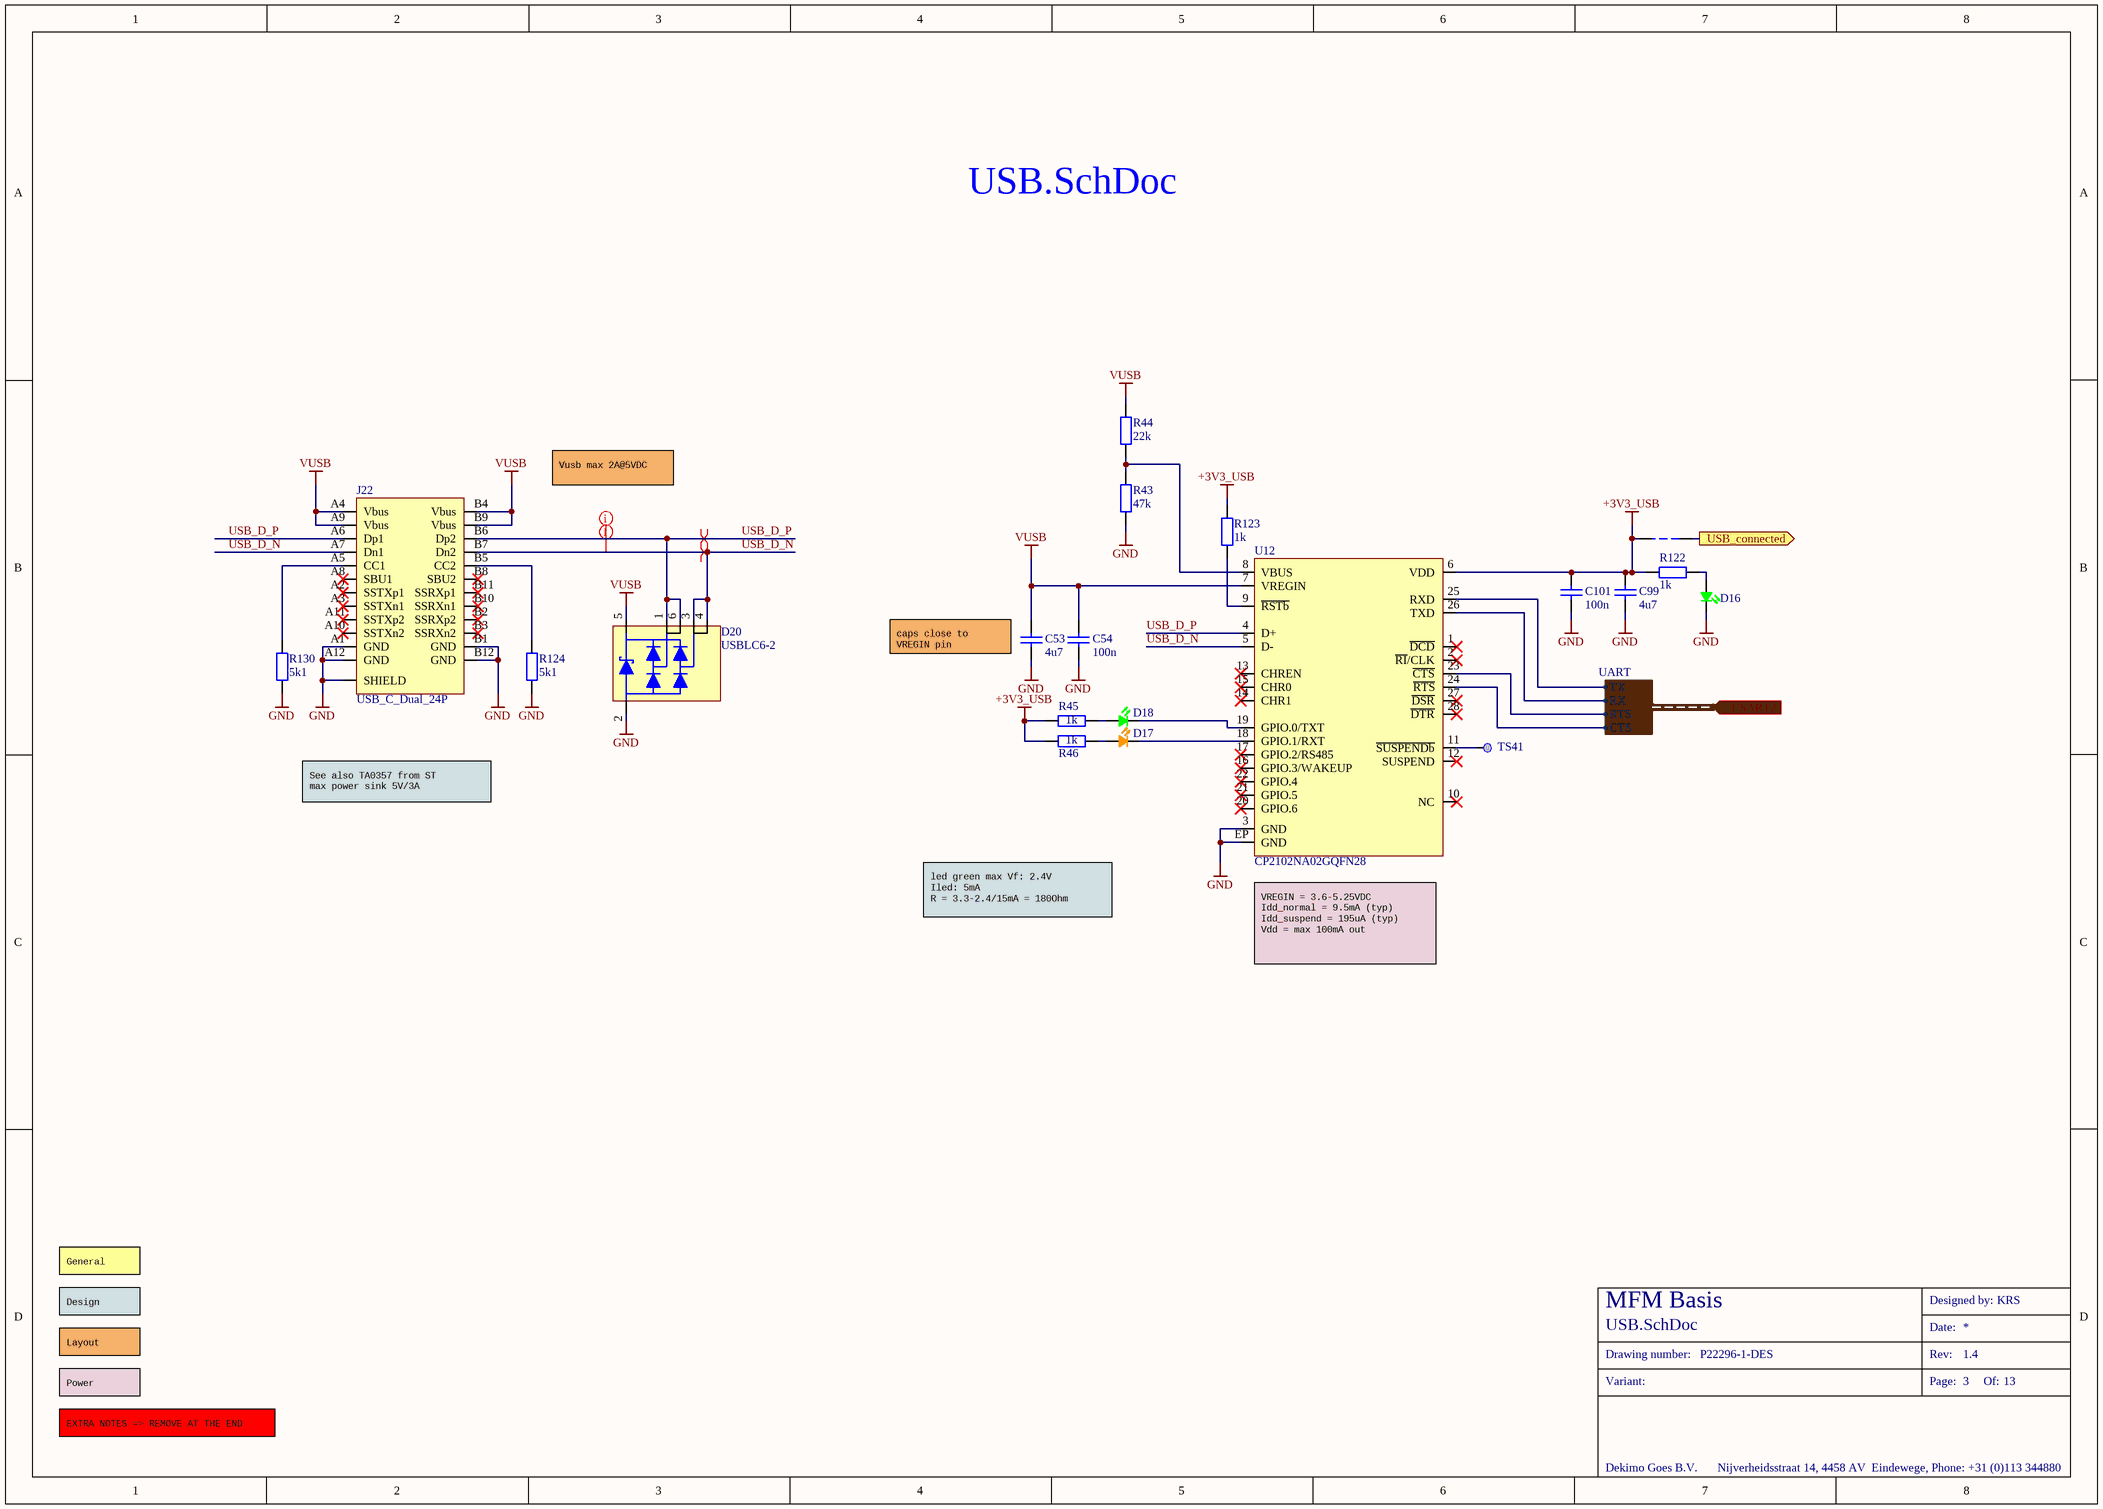
[diagram p11: USB.SchDoc]

### Parts
C53  4u7  [CAPC3216X13N]
C54  100n  [CAPC1608X09N]
C99  4u7  [CAPC3216X13N]
C101  100n  [CAPC1608X09N]
D16  (no value)  [LED_0603_ANODE]
D17  (no value)  [LED_0603]
D18  (no value)  [LED_0603_ANODE]
D20  USBLC6-2  [SOT95P280X110-6N]
J22  USB_C_Dual_24P  [CON-009G000-024]
NT1  NET_TIE2  [NET_TIE_02MM]  (value not drawn)  (net tie, no BOM)
R43  47k  [RESC1608X13N]
R44  22k  [RESC1608X13N]
R45  1k  [RESC1608X13N]
R46  1k  [RESC1608X13N]
R122  1k  [RESC1608X13N]
R123  1k  [RESC1608X13N]
R124  5k1  [RESC1608X13N]
R130  5k1  [RESC1608X13N]
TS41  TESTPAD  [TESTPAD 2MM]  (value not drawn)  (no BOM)
U12  CP2102NA02GQFN28  [QFN28_5x5mmP0.5]

### Ports
USART2 (in, harness UART), USB_connected (out)

### Harnesses
UART: CTS, RTS, RX, TX

### Nets
+3V3_USB: C99.2 C101.2 NT1.2 R45.2 R46.2 R122.1 R123.2 U12.6(VDD)
GND: C53.1 C54.1 C99.1 C101.1 D16.C D20.2(A) J22.A1(GND) J22.A12(GND) J22.B1(GND) J22.B12(GND) J22.S(SHIELD) R43.1 R124.1 R130.1 U12.3(GND) U12.EP(GND)
VUSB: C53.2 C54.2 D20.5(A) J22.A4(Vbus) J22.A9(Vbus) J22.B4(Vbus) J22.B9(Vbus) R44.2 U12.7(VREGIN)
USART2.CTS: U12.24(~{RTS}) ; port USART2.CTS
USART2.RTS: U12.23(~{CTS}) ; port USART2.RTS
USART2.RX: U12.26(TXD) ; port USART2.RX
USART2.TX: U12.25(RXD) ; port USART2.TX
USB_connected: NT1.1 ; port USB_connected
USB_D_N: D20.3(A) D20.4(A) J22.A7(Dn1) J22.B7(Dn2) U12.5(D-)  [project net USB_D_N_3]
USB_D_P: D20.1(A) D20.6(A) J22.A6(Dp1) J22.B6(Dp2) U12.4(D+)  [project net USB_D_P_3]
NetD16_A: D16.A R122.2
NetD17_A: D17.A R46.1
NetD17_C: D17.C U12.18(GPIO.1/RXT)
NetD18_A: D18.A R45.1
NetD18_C: D18.C U12.19(GPIO.0/TXT)
NetJ22_A5: J22.A5(CC1) R130.2
NetJ22_B5: J22.B5(CC2) R124.2
NetR43_2: R43.2 R44.1 U12.8(VBUS)
NetR123_1: R123.1 U12.9(~{RSTb})
NetTS41_1: TS41.1(TP) U12.11(~{SUSPENDb})

Not connected (* = marked no-connect by the designer): J22 A2(SSTXp1)* A3(SSTXn1)* A8(SBU1)* A10(SSTXn2)* A11(SSTXp2)* B2(SSRXp2)* B3(SSRXn2)* B8(SBU2)* B10(SSRXn1)* B11(SSRXp1)*; U12 1(~{DCD})* 2(~{RI}/CLK)* 10(NC)* 12(SUSPEND)* 13(CHREN)* 14(CHR1)* 15(CHR0)* 16(GPIO.3/WAKEUP)* 17(GPIO.2/RS485)* 20(GPIO.6)* 21(GPIO.5)* 22(GPIO.4)* 27(~{DSR})* 28(~{DTR})*

### Layout directives
net class 90R: USB_D_N_3, USB_D_P_3
differential pair; differential pair class USB: USB_D_N_3, USB_D_P_3

### Notes on the sheet
- Vusb max 2A@5VDC
- (near C53) caps close to VREGIN pin
- See also TA0357 from ST
  max power sink 5V/3A
- led green max Vf: 2.4V
  Iled: 5mA
  R = 3.3-2.4/15mA = 180Ohm
- (near U12) VREGIN = 3.6-5.25VDC
  Idd_normal = 9.5mA (typ)
  Idd_suspend = 195uA (typ)
  Vdd = max 100mA out
- Design
- General
- Layout
- Power
- EXTRA NOTES => REMOVE AT THE END
- Designed by:
- Drawing number:
- Variant:
- Date:
- Page:
- Rev:
- Of:
- Dekimo Goes B.V.
- Nijverheidsstraat 14, 4458 AV  Eindewege, Phone: +31 (0)113 344880

### Library data of the parts
C53 C99 = CKE 4U7V50/10: 4.7uF 50V 20% X5R; EngPartGrpMainCode: CAP; ManufactpartCode: C1206C475M5PAC-KEM; Type: Capacitor ceramic SMD; Preferred: False; SMD_Flag: True; PartCode: CKE 4U7V50/10
C54 C101 = CKE 100N/60: as C97 on sheet Memory; PartCode: CKE 100N/60
D16 D18 = LED SMDG/16: Led Groen 0603; EngPartGrpMainCode: OPTO; ManufactpartCode: 150060VS75003-WE; Type: LED SMD; Preferred: False; SMD_Flag: True; PartCode: LED SMDG/16
D17 = LED SMDO/3: Led Orange 0603; EngPartGrpMainCode: OPTO; ManufactpartCode: 150060AS75000-WE; Type: LED SMD; Preferred: False; SMD_Flag: True; PartCode: LED SMDO/3
D20 = DIO USBLC6: USB2 protector, 15kV/8kV; EngPartGrpMainCode: DIO; ManufactpartCode: USBLC6-2SC6-STM; Type: TVS diode array SMD; Preferred: False; SMD_Flag: True; PartCode: DIO USBLC6
J22 = CON USB-C/4: USB C vertical entry; EngPartGrpMainCode: CONN; ManufactpartCode: USB-C31-S-VT-CS4-BK-PP-T/R-ADT; Preferred: False; SMD_Flag: True; PartCode: CON USB-C/4; Type: Connector USB SMD
NT1 = NET_TIE: Net-Tie for 2 Nets; Value: DNP
R43 = R 47K/60: as R120 on sheet Memory; PartCode: R 47K/60; Type: Resistor metalfilm SMD
R44 = R 22K/60: 22K 0.1W 1%; EngPartGrpMainCode: RES; ManufactpartCode: RC0603FR-0722KL-YAG; Preferred: False; SMD_Flag: True; PartCode: R 22K/60; Type: Resistor metalfilm SMD
R45 R46 R122 R123 = R 1K/60: 1K, 100mW, 1%; PartCode: R 1K/60; EngPartGrpMainCode: RES; ManufactpartCode: RC0603FR-071KL-YAG; Preferred: True; Type: Resistor metalfilm SMD; SMD_Flag: True
R124 R130 = R 5K1/61: 5k1 0.1W 5%; EngPartGrpMainCode: RES; ManufactpartCode: RC0603JR-075K1L-YAG; Preferred: False; SMD_Flag: True; PartCode: R 5K1/61; Type: Resistor metalfilm SMD
TS41 = TESTPAD-2.0: 0.5mm Testpad SMD; PartCode: TESTPAD-2.0
U12 = IC CP2102N-A02: USB to UART Bridge; EngPartGrpMainCode: IC; ManufactpartCode: CP2102N-A02-GQFN28-SIL; Preferred: False; SMD_Flag: True; PartCode: IC CP2102N-A02; Type: IC interface SMD

## Sheet Power1.SchDoc: Titel
size A3; ApprovedBy: name; CompanyName: DCI Electronics bv; DrawnBy: KRS; Address1: Nijverheidsstraat 14; Address2: 4458 AV Eindewege; Address3: Phone: +31 (0)113 344880; DocumentNumber: 6; Revision: 2; SheetNumber: 6; SheetTotal: 14; PageSetup: Record=PageOptions|CenterHorizontal=True|CenterVertical=True|PrintScale=1.00|XCorrection=1.00|YCorrection=1.00|PrintKind=1|BorderSize=5000000|LeftOffset=0|BottomOffset=0|Orientation=2|PaperLength=1000|PaperWidth=1000|Scale=100|PaperSource=7|PrintQuality=-4|MediaType=1|DitherType=10|PaperKind=ISO_A4_(210.00_x_297.00_MM)|PrintScaleMode=1; SubTitle: SubTitel; ApprovedDate: 01-01-12; DesignedBy: HMK
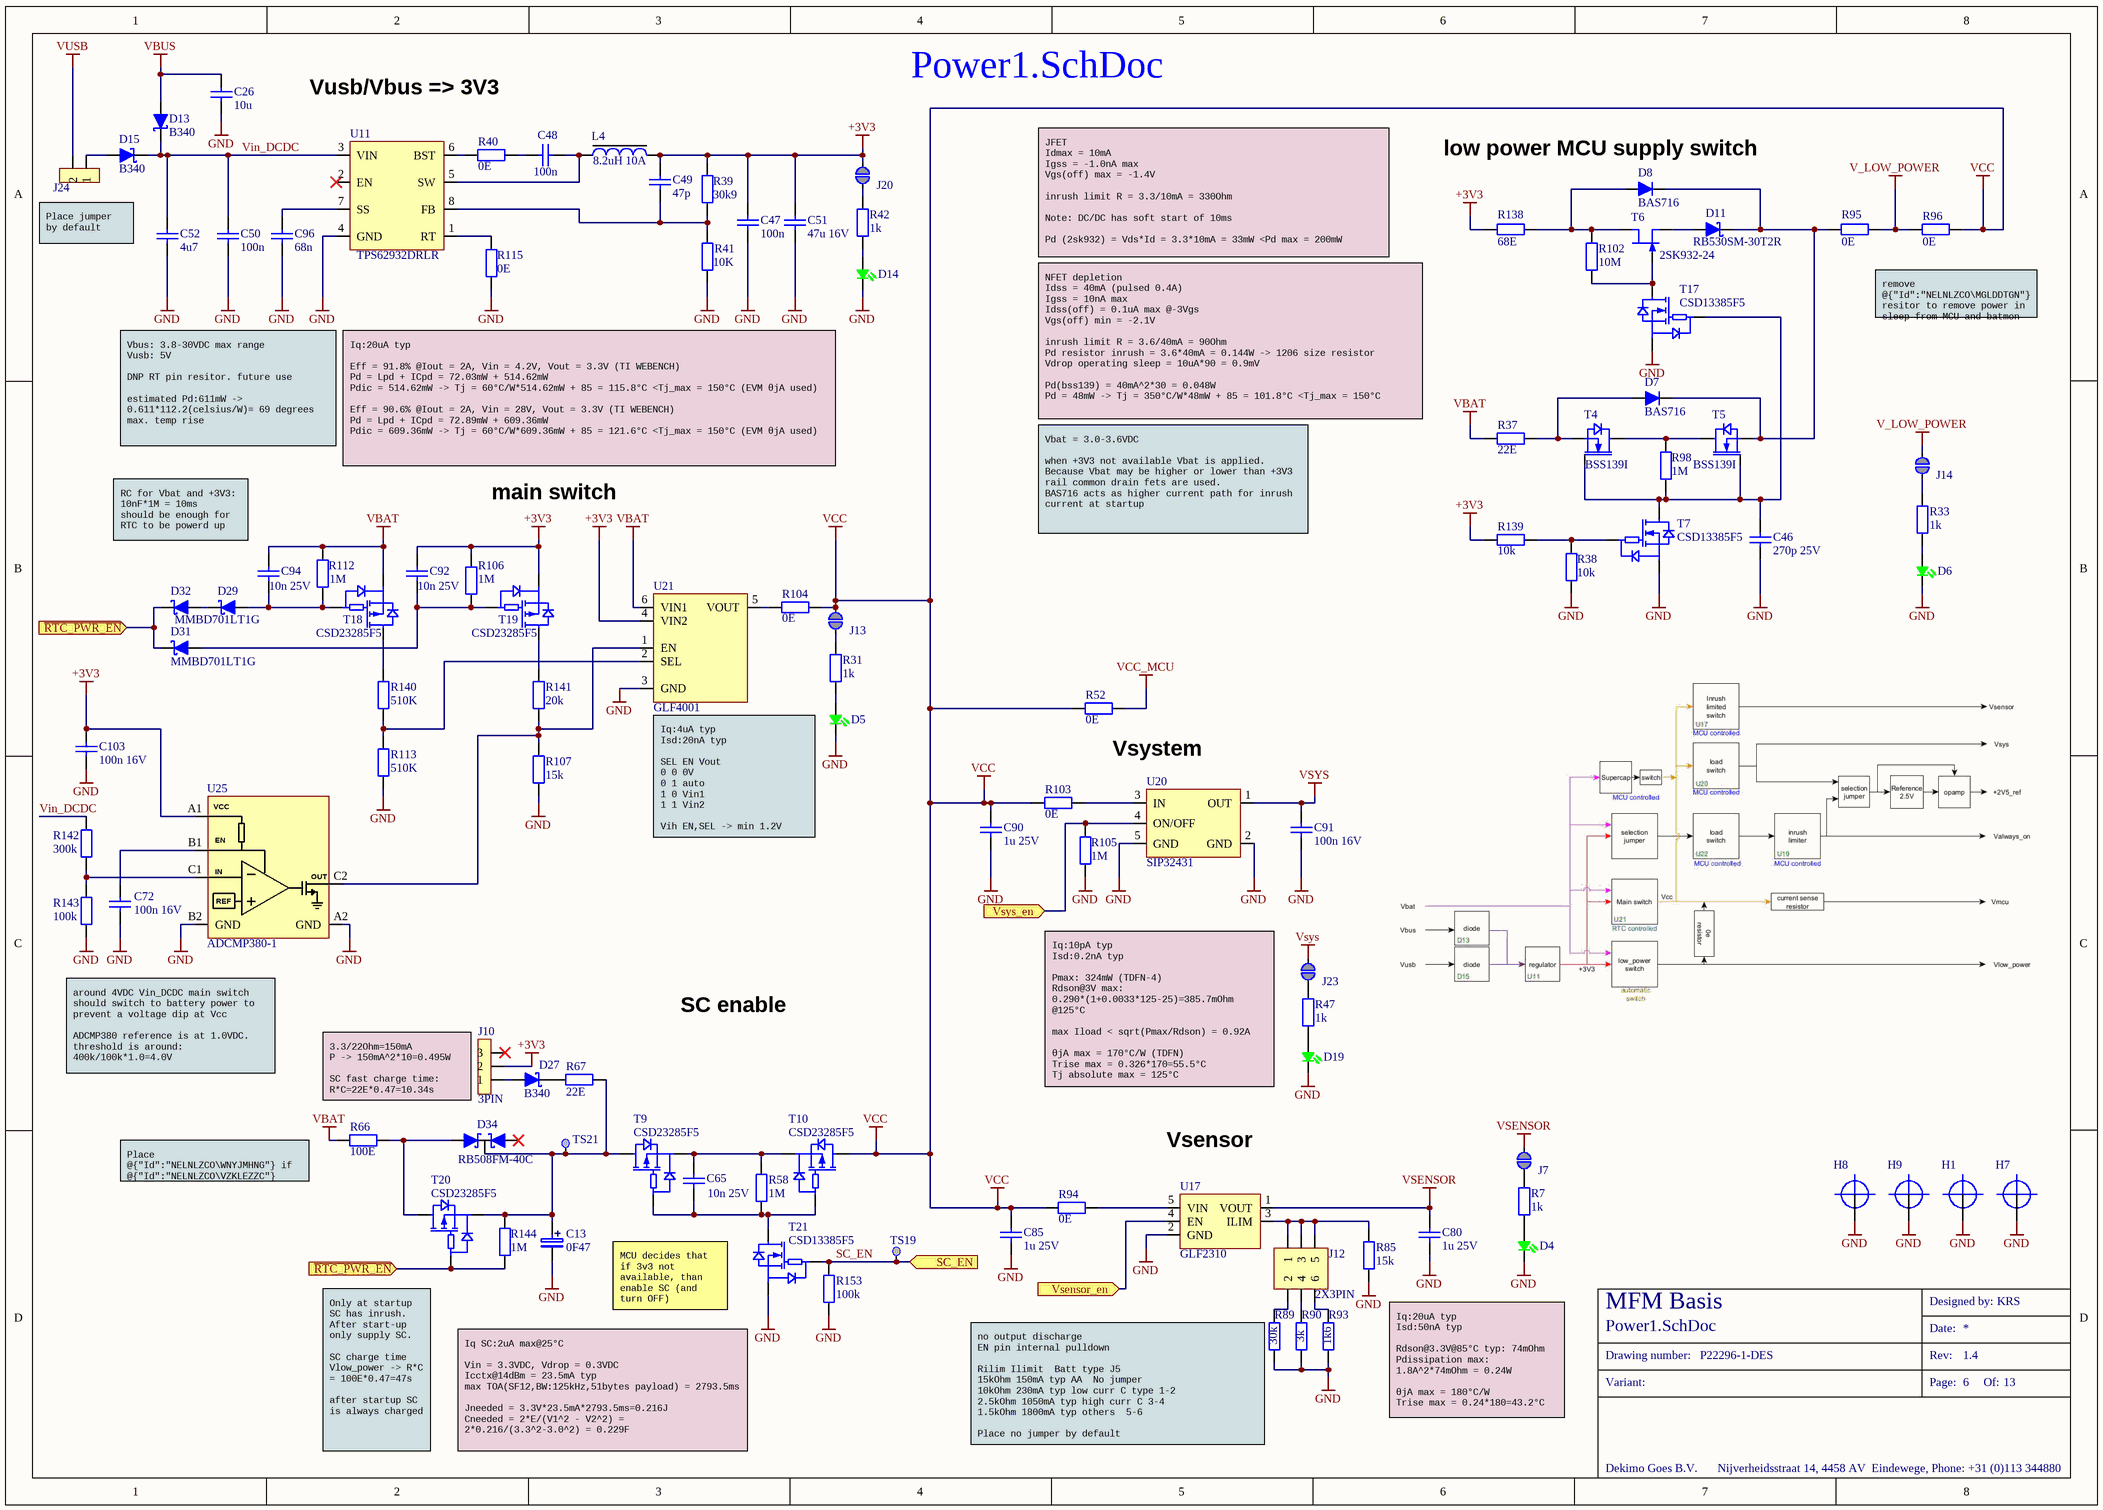
[diagram p12: Power1.SchDoc]

### Parts
C13  0F47  [CAP-003G000-002]
C26  10u  [CAPC3216X18N]
C46  270p 25V  [CAPC1005X05N]
C47  100n  [CAPC1608X09N]
C48  100n  [CAPC1608X09N]
C49  47p  [CAPC1608X09N]
C50  100n  [CAPC1608X09N]
C51  47u 16V  [CAPC3225X27N]
C52  4u7  [CAPC3216X13N]
C65  10n 25V  [CAPC1005X05N]
C72  100n 16V  [CAPC1005X05N]
C80  1u 25V  [CAPC1608X09N]
C85  1u 25V  [CAPC1608X09N]
C90  1u 25V  [CAPC1608X09N]
C91  100n 16V  [CAPC1005X05N]
C92  10n 25V  [CAPC1005X05N]
C94  10n 25V  [CAPC1005X05N]
C96  68n  [CAPC2013X14N]
C103  100n 16V  [CAPC1005X05N]
D4  (no value)  [LED_0603_ANODE]
D5  (no value)  [LED_0603_ANODE]
D6  (no value)  [LED_0603_ANODE]
D7  BAS716  [SODFL16080X62N]
D8  BAS716  [SODFL16080X62N]
D11  RB530SM-30T2R  [SODFL16080X62N]
D13  B340  [DIO-001001-002]
D14  (no value)  [LED_0603_ANODE]
D15  B340  [DIO-001001-002]
D19  (no value)  [LED_0603_ANODE]
D27  B340  [DIO-001001-002]
D29  MMBD701LT1G  [SOT95P245X110-3N]
D31  MMBD701LT1G  [SOT95P245X110-3N]
D32  MMBD701LT1G  [SOT95P245X110-3N]  (value not drawn)
D34  RB508FM-40C  [SOT-650G001-003]
H1  HOLE_PTH  [PTH_0.8_1.5]  (value not drawn)  (no BOM)
H7  HOLE_PTH  [PTH_0.8_1.5]  (value not drawn)  (no BOM)
H8  HOLE_PTH  [PTH_0.8_1.5]  (value not drawn)  (no BOM)
H9  HOLE_PTH  [PTH_0.8_1.5]  (value not drawn)  (no BOM)
J7  Solderbridge - Normally Open  [Solderbridge NO]  (value not drawn)  (no BOM)
J10  3PIN  [CON-003G000-003]
J12  2X3PIN  [CON-003G000-006]
J13  Solderbridge - Normally Open  [Solderbridge NO]  (value not drawn)  (no BOM)
J14  Solderbridge - Normally Open  [Solderbridge NO]  (value not drawn)  (no BOM)
J20  Solderbridge - Normally Open  [Solderbridge NO]  (value not drawn)  (no BOM)
J23  Solderbridge - Normally Open  [Solderbridge NO]  (value not drawn)  (no BOM)
J24  2PIN  [PHDR1X2_P2.54]  (value not drawn)
L4  8.2uH 10A  [IND-001G001-002]
R7  1k  [RESC1608X13N]
R31  1k  [RESC1608X13N]
R33  1k  [RESC1608X13N]
R37  22E  [RESC1608X13N]
R38  10k  [RESC1005X04N]
R39  30k9  [RESC2013X14N]
R40  0E  [RESC1608X13N]
R41  10K  [RESC1608X13N]
R42  1k  [RESC1608X13N]
R47  1k  [RESC1608X13N]
R52  0E  [RESC3116X13N]
R58  1M  [RESC1005x04N]
R66  100E  [RESC3116X13N]
R67  22E  [RESC2013X14N]
R85  15k  [RESC1608X13N]
R89  30k  [RESC1608X13N]
R90  3k  [RESC1608X13N]
R93  1k6  [RESC1608X13N]
R94  0E  [RESC1608X13N]
R95  0E  [RESC3116X13N]
R96  0E  [RESC2013X14N]
R98  1M  [RESC1608X13N]
R102  10M  [RESC1608X13N]
R103  0E  [RESC1608X13N]
R104  0E  [RESC2013X14N]
R105  1M  [RESC1005x04N]
R106  1M  [RESC1005x04N]
R107  15k  [RESC1608X13N]
R112  1M  [RESC1005x04N]
R113  510K  [RESC1005X04N]
R115  0E  [RESC1608X13N]
R138  68E  [RESC2013X14N]
R139  10k  [RESC1005X04N]
R140  510K  [RESC1005X04N]
R141  20k  [RESC1005X04N]
R142  300k  [RESC1005X04N]
R143  100k  [RESC1005X04N]
R144  1M  [RESC1005x04N]
R153  100k  [RESC1005X04N]
T4  BSS139I  [SOT95P245X110_GSD-3N]
T5  BSS139I  [SOT95P245X110_GSD-3N]
T6  2SK932-24  [SOT-950G000-003]
T7  CSD13385F5  [DFN-500G000-003]
T9  CSD23285F5  [DFN-500G000-003]
T10  CSD23285F5  [DFN-500G000-003]
T17  CSD13385F5  [DFN-500G000-003]
T18  CSD23285F5  [DFN-500G000-003]
T19  CSD23285F5  [DFN-500G000-003]
T20  CSD23285F5  [DFN-500G000-003]
T21  CSD13385F5  [DFN-500G000-003]
TS19  TESTPAD  [TESTPAD 2MM]  (value not drawn)  (no BOM)
TS21  TESTPAD  [TESTPAD 2MM]  (value not drawn)  (no BOM)
U11  TPS62932DRLR  [SOT-501001-008]
U17  GLF2310  [SOT95P280X115-5N]
U20  SIP32431  [DFN-500001-004]
U21  GLF4001  [SOT95P300X145-6N]
U25  ADCMP380-1  [BGA-500G001-006]

### Ports
SC_EN (in), Vsensor_en (in), Vsys_en (in), ~{RTC_PWR_EN} (in)

### Nets
+3V3: C47.2 C49.2 C51.2 C92.2 C103.1 J10.2 J20.2 L4.2 R39.2 R106.2 R138.1 R139.2 T19.S U21.4(VIN2) U25.A1(VCC)
GND: C13.- C26.1 C46.1 C47.1 C50.1 C51.1 C52.1 C72.1 C80.1 C85.1 C90.1 C91.1 C96.1 C103.2 D4.C D5.C D6.C D14.C D19.C H1.0 H7.0 H8.0 H9.0 R38.1 R41.1 R85.1 R89.1 R90.1 R93.1 R105.1 R107.1 R113.1 R115.1 R143.1 R153.1 T7.S T17.S T21.S U11.4(GND) U17.2(GND) U20.2(GND) U20.5(GND) U21.3(GND) U25.A2(GND) U25.B2(GND)
V_LOW_POWER: J14.2 R95.2 R96.1
VBAT: C94.2 R37.2 R66.2 R112.2 T18.S U21.6(VIN1)
VBUS: C26.2 D13.A
VCC: C85.2 C90.2 J13.2 R52.2 R94.1 R96.2 R103.1 R104.2 T10.D
VCC_MCU: R52.1
VSENSOR: C80.2 J7.2 U17.1(VOUT)
VSYS: C91.2 J23.2 U20.1(OUT)
VUSB: J24.2
~{RTC_PWR_EN}: D31.C D32.C R144.1 T20.G ; port ~{RTC_PWR_EN}
SC_EN: R153.2 T21.G TS19.1(TP) ; port SC_EN
Vin_DCDC: C50.2 C52.2 D13.C D15.C R142.2 U11.3(VIN)  [project net Vin_DCDC_6]
Vsensor_en: U17.4(EN) ; port Vsensor_en
Vsys_en: R105.2 U20.4(ON/OFF) ; port Vsys_en
NetC13_+: C13.+ D34.C R67.2 R144.2 T9.D T20.S TS21.1(TP)
NetC46_2: C46.2 R98.1 T4.G T5.G T7.D T17.G
NetC48_1: C48.1 L4.1 U11.5(SW)
NetC48_2: C48.2 R40.2
NetC49_1: C49.1 R39.1 R41.2 U11.8(FB)
NetC65_1: C65.1 R58.1 T9.G T10.G T21.D
NetC65_2: C65.2 R58.2 T9.S T10.S
NetC72_2: C72.2 U25.B1(EN)
NetC92_1: C92.1 D31.A R106.1 T19.G
NetC94_1: C94.1 D29.A R112.1 T18.G
NetC96_2: C96.2 U11.7(SS)
NetD4_A: D4.A R7.2
NetD5_A: D5.A R31.2
NetD6_A: D6.A R33.2
NetD7_A: D7.A R37.1 T4.D
NetD7_C: D7.C D8.C D11.C R95.1 T5.D
NetD8_A: D8.A R102.2 R138.2 T6.D
NetD11_A: D11.A T6.S
NetD14_A: D14.A R42.2
NetD15_A: D15.A J24.1
NetD19_A: D19.A R47.2
NetD27_A: D27.A J10.1
NetD27_C: D27.C R67.1
NetD29_C: D29.C D32.A
NetD34_A1: D34.A1 R66.1 T20.D
NetJ7_1: J7.1 R7.1
NetJ12_1: J12.1 J12.3 J12.5 R85.2 U17.3(ILIM)
NetJ12_2: J12.2 R89.2
NetJ12_4: J12.4 R90.2
NetJ12_6: J12.6 R93.2
NetJ13_1: J13.1 R31.1
NetJ14_1: J14.1 R33.1
NetJ20_1: J20.1 R42.1
NetJ23_1: J23.1 R47.1
NetR38_2: R38.2 R139.1 T7.G
NetR40_1: R40.1 U11.6(BST)
NetR94_2: R94.2 U17.5(VIN)
NetR98_2: R98.2 T4.S T5.S
NetR102_1: R102.1 T6.G T17.D
NetR103_2: R103.2 U20.3(IN)
NetR104_1: R104.1 U21.5(VOUT)
NetR107_2: R107.2 R141.1 U21.1(EN) U25.C2(OUT)
NetR113_2: R113.2 R140.1 U21.2(SEL)
NetR115_2: R115.2 U11.1(RT)
NetR140_2: R140.2 T18.D
NetR141_2: R141.2 T19.D
NetR142_1: R142.1 R143.2 U25.C1(IN)

Not connected (* = marked no-connect by the designer): D34 A2*; J10 3*; U11 2(EN)*

### Notes on the sheet
- Vusb/Vbus => 3V3
- (near D8) low power MCU supply switch
- Place jumper
  by default
- JFET
  Idmax = 10mA
  Igss = -1.0nA max
  Vgs(off) max = -1.4V
  inrush limit R = 3.3/10mA = 330Ohm
  Note: DC/DC has soft start of 10ms
  Pd (2sk932) = Vds*Id = 3.3*10mA = 33mW <Pd max = 200mW
- remove @{"Id":"NELNLZCO\MGLDDTGN"} resitor to remove power in sleep from MCU and batmon
- Vbus: 3.8-30VDC max range
  Vusb: 5V
  DNP RT pin resitor. future use
  estimated Pd:611mW -> 0.611*112.2(celsius/W)= 69 degrees max. temp rise
- NFET depletion
  Idss = 40mA (pulsed 0.4A)
  Igss = 10nA max
  Idss(off) = 0.1uA max @-3Vgs
  Vgs(off) min = -2.1V
  inrush limit R = 3.6/40mA = 90Ohm
  Pd resistor inrush = 3.6*40mA = 0.144W -> 1206 size resistor
  Vdrop operating sleep = 10uA*90 = 0.9mV
  Pd(bss139) = 40mA^2*30 = 0.048W
  Pd = 48mW -> Tj = 350°C/W*48mW + 85 = 101.8°C <Tj_max = 150°C
- Iq:20uA typ
  Eff = 91.8% @Iout = 2A, Vin = 4.2V, Vout = 3.3V (TI WEBENCH)
  Pd = Lpd + ICpd = 72.03mW + 514.62mW
  Pdic = 514.62mW -> Tj = 60°C/W*514.62mW + 85 = 115.8°C <Tj_max = 150°C (EVM θjA used)
  Eff = 90.6% @Iout = 2A, Vin = 28V, Vout = 3.3V (TI WEBENCH)
  Pd = Lpd + ICpd = 72.89mW + 609.36mW
  Pdic = 609.36mW -> Tj = 60°C/W*609.36mW + 85 = 121.6°C <Tj_max = 150°C (EVM θjA used)
- main switch
- (near C94) RC for Vbat and +3V3:
  10nF*1M = 10ms
  should be enough for RTC to be powerd up
- Vbat = 3.0-3.6VDC
  when +3V3 not available Vbat is applied. Because Vbat may be higher or lower than +3V3 rail common drain fets are used.
  BAS716 acts as higher current path for inrush current at startup
- Vsystem
- Iq:4uA typ
  Isd:20nA typ
  SEL	EN	Vout
  0	0	0V
  0	1	auto
  1	0	Vin1
  1	1	Vin2
  Vih EN,SEL -> min 1.2V
- SC enable
- around 4VDC Vin_DCDC main switch should switch to battery power to prevent a voltage dip at Vcc
  ADCMP380 reference is at 1.0VDC.
  threshold is around:
  400k/100k*1.0=4.0V
- (near J10) 3.3/22Ohm=150mA
  P -> 150mA^2*10=0.495W
  SC fast charge time:
  R*C=22E*0.47=10.34s
- Iq:10pA typ
  Isd:0.2nA typ
  Pmax: 324mW (TDFN-4)
  Rdson@3V max: 0.290*(1+0.0033*125-25)=385.7mOhm @125°C
  max Iload < sqrt(Pmax/Rdson) = 0.92A
  θjA max = 170°C/W (TDFN)
  Trise max = 0.326*170=55.5°C
  Tj absolute max = 125°C
- (near R66) Place @{"Id":"NELNLZCO\WNYJMHNG"} if @{"Id":"NELNLZCO\VZKLEZZC"} circuit doesn't function
- Vsensor
- MCU decides that if 3v3 not available, than enable SC (and turn OFF)
- (near T20) Only at startup SC has inrush. After start-up only supply SC.
  SC charge time Vlow_power -> R*C = 100E*0.47=47s
  after startup SC is always charged
- Iq SC:2uA max@25°C
  Vin = 3.3VDC, Vdrop = 0.3VDC
  Icctx@14dBm = 23.5mA typ
  max TOA(SF12,BW:125kHz,51bytes payload) = 2793.5ms
  Jneeded = 3.3V*23.5mA*2793.5ms=0.216J
  Cneeded = 2*E/(V1^2 - V2^2) = 2*0.216/(3.3^2-3.0^2) = 0.229F
- (near R89) no output discharge
  EN pin internal pulldown
  Rilim	Ilimit		Batt type	J5
  15kOhm	150mA typ	AA		No jumper
  10kOhm	230mA typ	low curr C type	1-2
  2.5kOhm	1050mA typ	high curr C	3-4
  1.5kOhm	1800mA typ	others		5-6
  Place no jumper by default
- Iq:20uA typ
  Isd:50nA typ
  Rdson@3.3V@85°C typ: 74mOhm
  Pdissipation max: 1.8A^2*74mOhm = 0.24W
  θjA max = 180°C/W
  Trise max = 0.24*180=43.2°C
- Designed by:
- Drawing number:
- Variant:
- Date:
- Page:
- Rev:
- Of:
- Dekimo Goes B.V.
- Nijverheidsstraat 14, 4458 AV  Eindewege, Phone: +31 (0)113 344880
- (in symbol IC ADCMP380-1) REF

### Library data of the parts
C13 = SC 470MV3.9/10: 0F47 3V9 supercap; EngPartGrpMainCode: CAP; ManufactpartCode: PHVL-3R9H474-R-EAT; Type: Capacitor electrol. SMD; Preferred: False; SMD_Flag: True; PartCode: SC 470MV3.9/10
C26 = CKE 10UV50/10: 10uF 50V 20% X5R; EngPartGrpMainCode: CAP; ManufactpartCode: GRM31CR61H106KA12L -MUR; Type: Capacitor ceramic SMD; Preferred: False; SMD_Flag: True; PartCode: CKE 10UV50/10
C46 = CKE 270P/70: 270pF, 25V, 5% COG; EngPartGrpMainCode: CAP; ManufactpartCode: CC0402JRNPO8BN271-YAG; Type: Capacitor ceramic SMD; Preferred: False; SMD_Flag: True; PartCode: CKE 270P/70
C47 C48 C50 = CKE 100N/60: as C97 on sheet Memory; PartCode: CKE 100N/60
C49 = CKE 47P/60: as C43 on sheet RTC; PartCode: CKE 47P/60
C51 = CKE 47UV16/15: 47uF 16V 20% X5R; EngPartGrpMainCode: CAP; ManufactpartCode: EMK325BJ476MM-P-TAI; Type: Capacitor ceramic SMD; Preferred: False; SMD_Flag: True; PartCode: CKE 47UV16/15
C52 = CKE 4U7V50/10: as C53 on sheet USB; PartCode: CKE 4U7V50/10
C65 C92 C94 = CKE 10NV25/70: 10nF, 25V 10%; EngPartGrpMainCode: CAP; ManufactpartCode: 04023C103KAT2A-AVX; Type: Capacitor ceramic SMD; Preferred: False; SMD_Flag: True; PartCode: CKE 10NV25/70
C72 C91 C103 = CKE 100N/70: 100nF, 16V, 10%, X7R; EngPartGrpMainCode: CAP; ManufactpartCode: CC0402KRX7R7BB104-YAG; Type: Capacitor ceramic SMD; Preferred: False; SMD_Flag: True; PartCode: CKE 100N/70
C80 C85 C90 = CKE 1U/61: 1UF, 25V, 10%, 0603, X7R; EngPartGrpMainCode: CAP; ManufactpartCode: CL10B105KA8NNNC-SAM; Type: Capacitor ceramic SMD; Preferred: False; SMD_Flag: True; PartCode: CKE 1U/61
C96 = CKE 68N/11: 68nF 50V 10%; EngPartGrpMainCode: CAP; ManufactpartCode: C0805C683K5RECAUTO-KEM; Type: Capacitor ceramic SMD; Preferred: False; SMD_Flag: True; PartCode: CKE 68N/11
D4-D6 D14 D19 = LED SMDG/16: as D16 on sheet USB; PartCode: LED SMDG/16
D7 D8 = DIO BAS716: BAS716 85V 200mA; EngPartGrpMainCode: DIO; ManufactpartCode: BAS716,115-NEX; Type: Diode SMD; Preferred: False; SMD_Flag: True; PartCode: DIO BAS716
D11 = DIO RB530SM-30T: 30V 200mA; EngPartGrpMainCode: DIO; ManufactpartCode: RB530SM-30T2R-RO; Type: Diode schottky SMD; Preferred: False; SMD_Flag: True; PartCode: DIO RB530SM-30T
D13 D15 D27 = DIO B340A: 40V, 3A; EngPartGrpMainCode: DIO; ManufactpartCode: B340A-13-F-DIO; Type: Diode schottky SMD; Preferred: False; SMD_Flag: True; PartCode: DIO B340A
D29 D31 D32 = DIO MMBD701LT1G: as D28 on sheet RTC; PartCode: DIO MMBD701LT1G
D34 = DIO RB508FM-40C: RB508, 40V, 80mA 2 com cat dio; ManufactpartCode: RB508FM-40CFHT106-RO; Type: Diode SMD; Preferred: False; SMD_Flag: True; PartCode: DIO RB508FM-40C; EngPartGrpMainCode: DIO
J7 J13 J14 J20 J23 = SolderbridgeNO: Solderbridge  - Normally Open
J10 = CON PHDR1X3S/11: pinh 1x3/straight/Au/1.27pitch; EngPartGrpMainCode: CONN; ManufactpartCode: M50-3630342-HAR; Preferred: False; SMD_Flag: True; PartCode: CON PHDR1X3S/11; Type: Connector pinhdr SMD
J12 = CON PHDR2X3S/4: 2x3/straight/Au/1.27mm; EngPartGrpMainCode: CONN; ManufactpartCode: 20021121-00006T4LF-AMH; Preferred: False; SMD_Flag: True; PartCode: CON PHDR2X3S/4; Type: Connector pinhdr SMD
J24 = CON PHDR1X2S/1: pinh 1x2/straight/h=5.8/Au; EngPartGrpMainCode: CONN; ManufactpartCode: 0-826629-2-TEC; Preferred: False; PartCode: CON PHDR1X2S/1; Type: Connector Pinheader; SMD_Flag: False
L4 = IND 8U2 10A/1: 8.2uH, 10A 33.4mOhm SMD; EngPartGrpMainCode: IND; ManufactpartCode: SRP1038CC-8R2M-BRN; Type: Inductor choke SMD; Preferred: False; SMD_Flag: True; PartCode: IND 8U2 10A/1
R7 R31 R33 R42 R47 = R 1K/60: as R45 on sheet USB; Type: Resistor metalfilm SMD; SMD_Flag: True
R37 = R 22E/60: 22E 0.1W 1%; EngPartGrpMainCode: RES; ManufactpartCode: RC0603FR-0722RL-YAG; Preferred: True; PartCode: R 22E/60; Type: Resistor metalfilm SMD; SMD_Flag: True
R38 R139 = R 10K/70: 10K, 62.5mW, 1%; EngPartGrpMainCode: RES; ManufactpartCode: RC0402FR-0710KL-YAG; Preferred: False; SMD_Flag: True; PartCode: R 10K/70; Type: Resistor metalfilm SMD
R39 = R 30K9/11: 30k9 0.1W 1%; EngPartGrpMainCode: RES; ManufactpartCode: RC0805FR-0730K9L-YAG; Preferred: False; SMD_Flag: True; PartCode: R 30K9/11; Type: Resistor metalfilm SMD
R40 R94 R103 R115 = R 0E/60: as R84 on sheet RTC; Type: Resistor metalfilm SMD; SMD_Flag: True
R41 = R 10K/60: 10k 100mW, 1%; EngPartGrpMainCode: RES; ManufactpartCode: RC0603FR-0710KL-YAG; Preferred: True; PartCode: R 10K/60; Type: Resistor metalfilm SMD; SMD_Flag: True
R52 R95 = R 0E/10: PartCode: R 0E/10; EngPartGrpMainCode: RES; ManufactpartCode: RC1206FR-070RL-YAG; Preferred: True; Type: Resistor metalfilm SMD; SMD_Flag: True
R58 R105 R106 R112 R144 = R 1M/70: 1M, 62.5mW, 1%; PartCode: R 1M/70; EngPartGrpMainCode: RES; ManufactpartCode: RC0402FR-071ML-YAG; Preferred: False; SMD_Flag: True; Type: Resistor metalfilm SMD
R66 = R 100E/10: 100E 0.25W 1%; EngPartGrpMainCode: RES; ManufactpartCode: RC1206FR-07100RL-YAG; Preferred: True; PartCode: R 100E/10; Type: Resistor metalfilm SMD; SMD_Flag: True
R67 = R 22E/17: 22E 0.5W 5%; EngPartGrpMainCode: RES; ManufactpartCode: SG73P2ATTD220G-KOA; Preferred: False; SMD_Flag: True; PartCode: R 22E/17; Type: Resistor metalfilm SMD
R85 R107 = R 15K/60: 15k 100mW 1%; EngPartGrpMainCode: RES; ManufactpartCode: RC0603FR-0715KL-YAG; Preferred: False; SMD_Flag: True; PartCode: R 15K/60; Type: Resistor metalfilm SMD
R89 = R 30K/60: 30k 100mW, 1%; EngPartGrpMainCode: RES; ManufactpartCode: RC0603FR-0730KL-YAG; Preferred: False; SMD_Flag: True; PartCode: R 30K/60; Type: Resistor metalfilm SMD
R90 = R 3K/60: 3k 0.1W 1%; PartCode: R 3K/60; EngPartGrpMainCode: RES; ManufactpartCode: RC0603FR-073KL-YAG; Preferred: False; SMD_Flag: True; Type: Resistor metalfilm SMD
R93 = R 1K6/60: 1.6k 100mW 1%; EngPartGrpMainCode: RES; ManufactpartCode: RC0603FR-071K6L-YAG; Preferred: False; SMD_Flag: True; PartCode: R 1K6/60; Type: Resistor metalfilm SMD
R96 R104 = R 0E/11: 0E 0.125W 5%; PartCode: R 0E/11; EngPartGrpMainCode: RES; ManufactpartCode: RC0805JR-070RL-YAG; Preferred: True; Type: Resistor metalfilm SMD; SMD_Flag: True
R98 = R 1M/60: as R27 on sheet RTC; Type: Resistor metalfilm SMD
R102 = R 10M/60: 10M 0.1W 1%; EngPartGrpMainCode: RES; ManufactpartCode: RC0603FR-0710ML-YAG; Preferred: False; SMD_Flag: True; PartCode: R 10M/60; Type: Resistor metalfilm SMD
R113 R140 = R 510K/70: 510K 62.5mW 1%; EngPartGrpMainCode: RES; ManufactpartCode: RC0402FR-10510KL-YAG; Preferred: False; SMD_Flag: True; PartCode: R 510K/70; Type: Resistor metalfilm SMD
R138 = R 68E/11: 68E  0.125W 1%; EngPartGrpMainCode: RES; ManufactpartCode: CRG0805F68R TYC; Preferred: False; SMD_Flag: True; PartCode: R 68E/11; Type: Resistor metalfilm SMD
R141 = R 20K/70: 20K 1% 0.1W; EngPartGrpMainCode: RES; ManufactpartCode: RC0402FR-0720KP-YAG; Preferred: False; SMD_Flag: True; PartCode: R 20K/70; Type: Resistor metalfilm SMD
R142 = R 300K/70: 300K, 62.5mW, 1%; EngPartGrpMainCode: RES; ManufactpartCode: RC0402FR-07300KL-YAG; Preferred: False; SMD_Flag: True; PartCode: R 300K/70; Type: Resistor metalfilm SMD
R143 R153 = R 100K/70: 100K, 62.5mW, 1%; EngPartGrpMainCode: RES; ManufactpartCode: RC0402FR-07100KL-YAG; Preferred: False; SMD_Flag: True; PartCode: R 100K/70; Type: Resistor metalfilm SMD
T4 T5 = TRA BSS139I: 30mA, 250V, 30Rds; EngPartGrpMainCode: TRAN; ManufactpartCode: BSS139IXTSA1-INF; Type: FET N-channel SMD; Preferred: False; SMD_Flag: True; PartCode: TRA BSS139I
T6 = TRA 2SK932-24: 50mA, 15V, JFET N-channel; EngPartGrpMainCode: TRAN; ManufactpartCode: 2SK932-24-TB-E-ONS; Type: FET N-channel SMD; Preferred: False; SMD_Flag: True; PartCode: TRA 2SK932-24
T7 T17 T21 = TRA CSD13385F5: 7.1A, 12V, N-channel FemtoFet; EngPartGrpMainCode: TRAN; ManufactpartCode: CSD13385F5-TI; Type: FET N-channel SMD; Preferred: False; SMD_Flag: True; PartCode: TRA CSD13385F5
T9 T10 T18-T20 = TRA CSD23285F5: 3.3A, 12V, P-channel FemtoFet; EngPartGrpMainCode: TRAN; ManufactpartCode: CSD23285F5-TI; Type: FET P-channel SMD; Preferred: False; SMD_Flag: True; PartCode: TRA CSD23285F5
TS19 TS21 = TESTPAD-2.0: 0.5mm Testpad SMD; PartCode: TESTPAD-2.0
U11 = IC TPS62932: Buck 3.8-30V to 0.2-22V 2A; EngPartGrpMainCode: IC; ManufactpartCode: TPS62932DRLR-TI; Preferred: False; SMD_Flag: True; PartCode: IC TPS62932; Type: IC regulator SMD
U17 = IC GLF2310A-T1: load sw adj current limit 5.5V; EngPartGrpMainCode: IC; ManufactpartCode: GLF2310A-T1G7-GLF; Preferred: False; SMD_Flag: True; PartCode: IC GLF2310A-T1; Type: IC switch SMD
U20 = IC SIP32431DN: load sw, 5.5V, 10pA Ishutdown; EngPartGrpMainCode: IC; ManufactpartCode: SIP32431DNP3-T1GE4-VIS; Preferred: False; SMD_Flag: True; PartCode: IC SIP32431DN; Type: IC switch SMD
U21 = IC GLF4001: Power mulitplexer, 5.5V, 2A; EngPartGrpMainCode: IC; ManufactpartCode: GLF4001-GLF; Preferred: False; SMD_Flag: True; PartCode: IC GLF4001; Type: IC switch SMD
U25 = IC ADCMP380-1: LM293 dual comparator; EngPartGrpMainCode: IC; ManufactpartCode: ADCMP380-1ACBZ-RL7-AD; Preferred: False; SMD_Flag: True; PartCode: IC ADCMP380-1; Type: IC comparator SMD